# Altium project LTO 16S BMS v1.0.PrjPcb
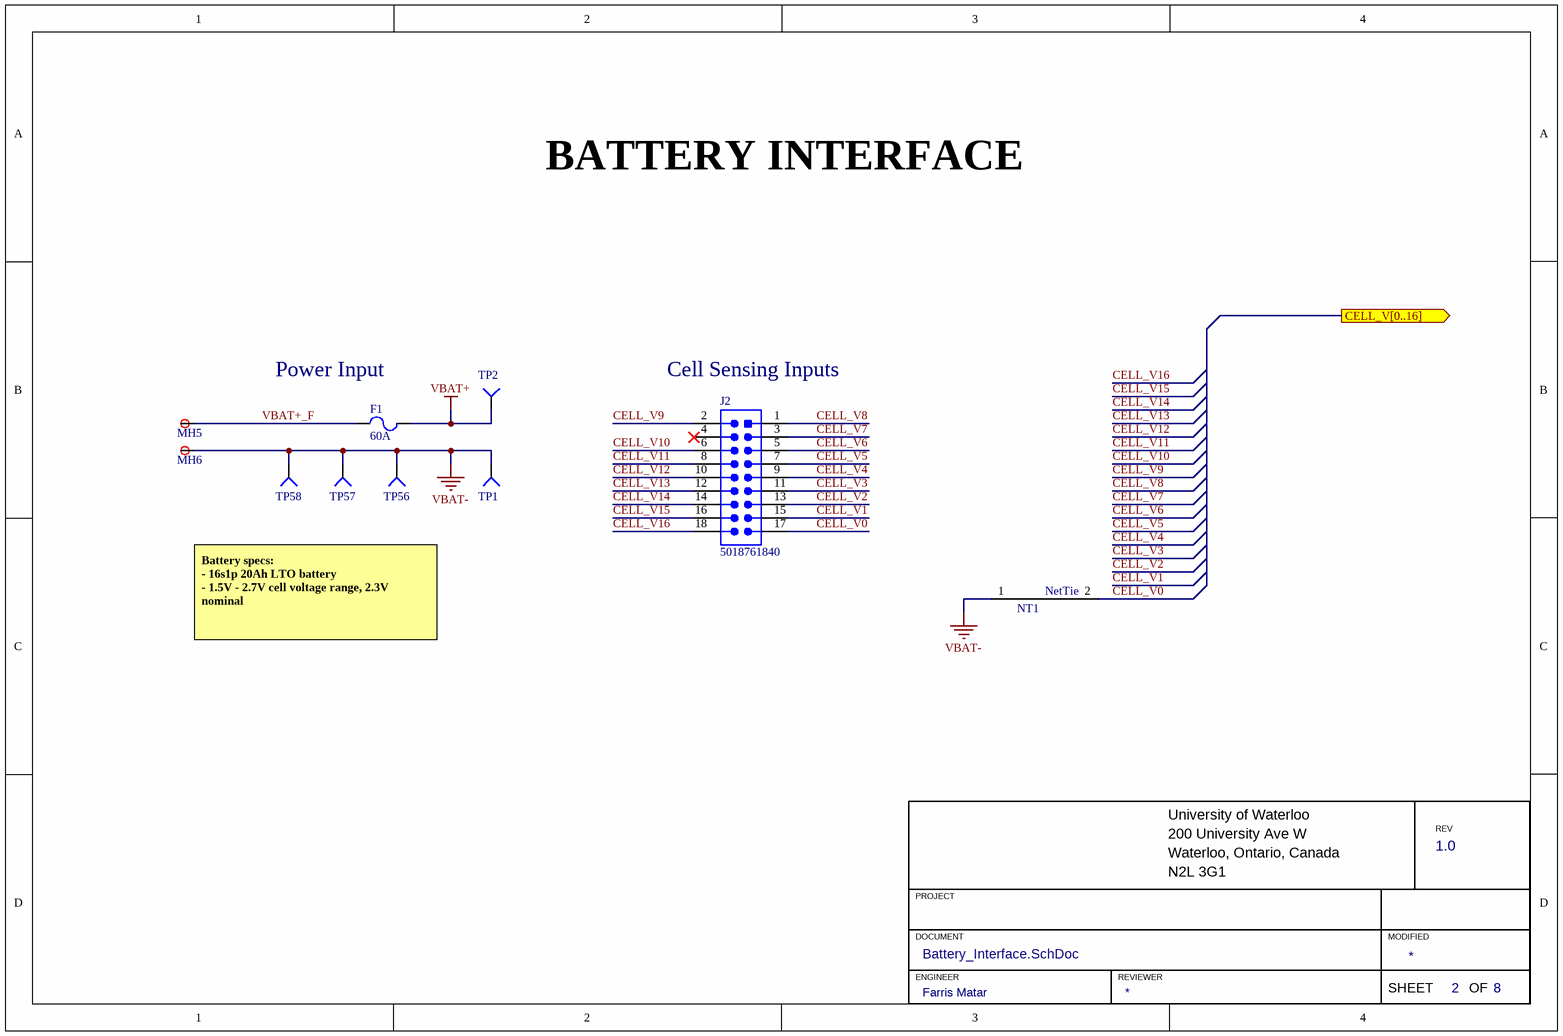
[diagram p0: Battery_Interface.SchDoc]
Engineer: Farris Matar; Revision: 1.0; Title: LTO 16S BMS
7 sheets, 250 parts. Net scope: hierarchical (ports join the sheet entries above them; power ports are global).
Board file: LTO 16S BMS.PcbDoc
Sheets:
  Battery_Interface.SchDoc
  BQ76952_AFE.SchDoc
    Balancing FETs = Balancing_FETs.SchDoc
  High_Side_FETs.SchDoc
  STM32_MCU.SchDoc
  Temperature_Sense.SchDoc
  Pack_Interface.SchDoc

## Sheet Battery_Interface.SchDoc: LTO 16S BMS
size A4; Engineer: Farris Matar; Organization: TESLA Motors, INC; Address1: 3500 Deer Creek Road; Address2: Palo Alto, CA; Address4: U.S.A.; SheetNumber: 2; SheetTotal: 8

### Parts
F1  Current Rating: 60A  [FUSE_456SDE_LITTLEFUSE]  (hidden comment: FUSE_60A_LITTLEFUSE)
J2  5018761840  [MOLEX-IGRID 9X2 THRA]
MH5  MOUNTING_HOLE_M5  [MOUNTING_HOLE_5mm]  (value not drawn)  (no BOM)
MH6  MOUNTING_HOLE_M5  [MOUNTING_HOLE_5mm]  (value not drawn)  (no BOM)
NT1  NetTie  [NET_TIE]  (value not drawn)
TP1  TESTPOINT_SMD_LOOP  [S1751-46R]  (value not drawn)
TP2  TESTPOINT_SMD_LOOP  [S1751-46R]  (value not drawn)
TP56  TESTPOINT_SMD_LOOP  [S1751-46R]  (value not drawn)
TP57  TESTPOINT_SMD_LOOP  [S1751-46R]  (value not drawn)
TP58  TESTPOINT_SMD_LOOP  [S1751-46R]  (value not drawn)

### Ports
CELL_V[0..16] (out)

### Nets
VBAT+: F1.2 TP2.1(=value)
VBAT-: MH6.0 NT1.1 TP1.1(=value) TP56.1(=value) TP57.1(=value) TP58.1(=value)
CELL_V0: J2.17 NT1.2
CELL_V1: J2.15
CELL_V2: J2.13
CELL_V3: J2.11
CELL_V4: J2.9
CELL_V5: J2.7
CELL_V6: J2.5
CELL_V7: J2.3
CELL_V8: J2.1
CELL_V9: J2.2
CELL_V10: J2.6
CELL_V11: J2.8
CELL_V12: J2.10
CELL_V13: J2.12
CELL_V14: J2.14
CELL_V15: J2.16
CELL_V16: J2.18
VBAT+_F: F1.1 MH5.0

Not connected (* = marked no-connect by the designer): J2 4*

### Notes on the sheet
- BATTERY INTERFACE
- (near F1) Power Input
- (near J2) Cell Sensing Inputs
- Battery specs:
  - 16s1p 20Ah LTO battery
  - 1.5V - 2.7V cell voltage range, 2.3V nominal
- University of Waterloo
- 200 University Ave W
- REV
- PROJECT
- Waterloo, Ontario, Canada
- N2L 3G1
- DOCUMENT
- ENGINEER
- REVIEWER
- MODIFIED
- SHEET
- OF

### Library data of the parts
F1 = FUSE_60A_LITTLEFUSE: FUSE BRD MT 60A 250VAC 80VDC SMD; Manufacturer 1: Littelfuse Inc.; Manufacturer Part Number 1: 0456060.DRSDE; Mounting Type: SMD; Verified: No; Supplier 1: Digi-Key; Supplier Part Number 1: 18-0456060.DRSDECT-ND
J2 = CON_MOLEX-IGRID_9x2_THRA: CONN HEADER R/A 18POS 2MM; Manufacturer 1: Molex; Voltage Rating: 250V; Current Rating: 7.5A; Pitch: 2mm; Supplier 1: Digi-Key; Supplier Part Number 1: WM12314-ND; Manufacturer Part Number 1: 5018761840
TP1 TP2 TP56-TP58 = TESTPOINT_SMD_LOOP: TESTPOINT SMD LOOP; Manufacturer 1: Harwin; Supplier 1: Digi-Key; Manufacturer Part Number 1: S1751-46R; Mounting Type: SMD; Package/Footprint: SMD; Supplier Part Number 1: 952-1478-1-ND

## Sheet BQ76952_AFE.SchDoc: LTO 16S BMS
size A4; Engineer: Farris Matar; Organization: TESLA Motors, INC; Address1: 3500 Deer Creek Road; Address2: Palo Alto, CA; Address4: U.S.A.; SheetNumber: 3; SheetTotal: 8
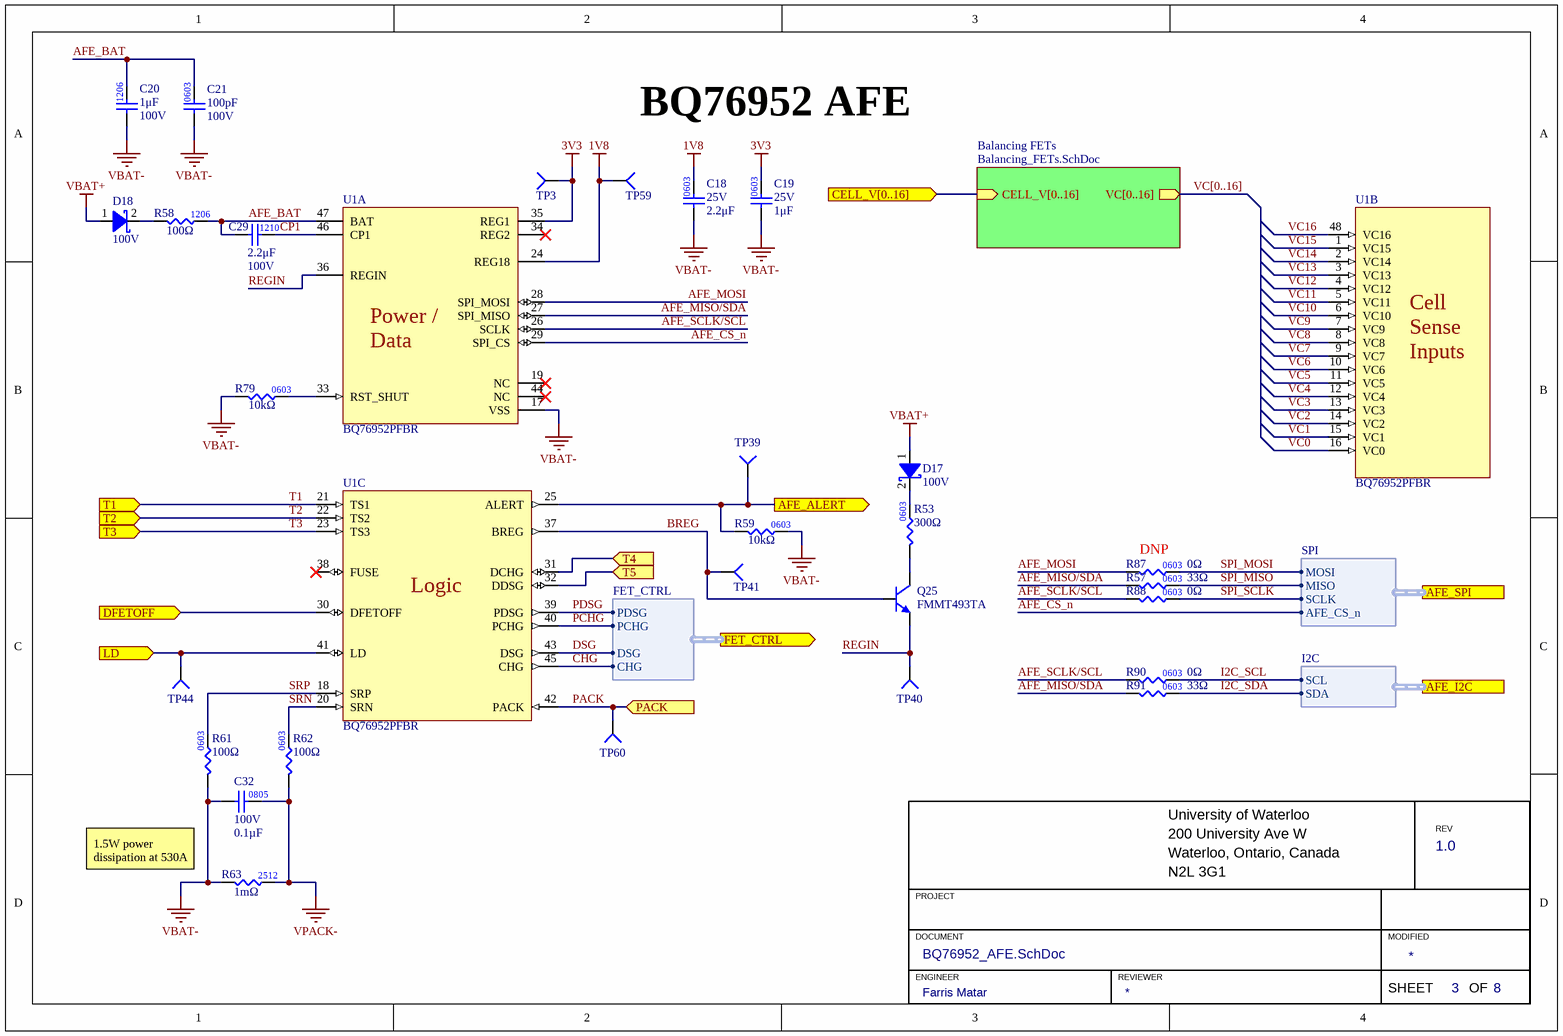
[diagram p1: BQ76952_AFE.SchDoc]

### Parts
C18  value 2.2μF  Voltage Rating: 25V  [CAP0603]  (hidden comment: CAP_2.2uF_25V_0603)
C19  value 1μF  Voltage Rating: 25V  [CAP0603]  (hidden comment: CAP_1uF_25V_0603)
C20  value 1μF  Voltage Rating: 100V  [CAP1206]  (hidden comment: CAP_1uF_100V_1206)
C21  value 100pF  Voltage Rating: 100V  [CAP2012]  (hidden comment: CAP_100pF_100V_0603)
C29  value 2.2μF  Voltage Rating: 100V  [CAP1210]  (hidden comment: CAP_2.2uF_100V_1210)
C32  value 0.1µF  Voltage Rating: 100V  [CAP0805]  (hidden comment: CAP_0.1uF_100V_0805)
D17  Vr (Max): 100V  [SOD-123_FLAT]  (hidden comment: DIO_SCHOTTKY_100V_1A)
D18  Vr (Max): 100V  [SOD-123_FLAT]  (hidden comment: DIO_SCHOTTKY_100V_1A)
Q25  Manufacturer Part Number 1: FMMT493TA  [SOT23-3]  (hidden comment: NPN_100V_1A)
R53  value 300Ω  [RES0603]  (hidden comment: RES_300Ω_0603_1%)
R57  value 33Ω  [RES0603]  (hidden comment: RES_33Ω_0603_1%)
R58  value 100Ω  [RES1206]  (hidden comment: RES_100Ω_1206_1%)
R59  value 10kΩ  [RES0603]  (hidden comment: RES_10kΩ_0603_1%)
R61  value 100Ω  [RES0603]  (hidden comment: RES_100Ω_0603_1%)
R62  value 100Ω  [RES0603]  (hidden comment: RES_100Ω_0603_1%)
R63  value 1mΩ  [RESC6532X75N]  (hidden comment: RES_1mΩ_2512_1%)
R79  value 10kΩ  [RES0603]  (hidden comment: RES_10kΩ_0603_1%)
R87  value 0Ω  [RES0603]  (hidden comment: RES_0Ω_0603)
R88  value 0Ω  [RES0603]  (hidden comment: RES_0Ω_0603)
R90  value 0Ω  [RES0603]  (hidden comment: RES_0Ω_0603)
R91  value 33Ω  [RES0603]  (hidden comment: RES_33Ω_0603_1%)
TP3  TESTPOINT_SMD_LOOP  [S1751-46R]  (value not drawn)
TP39  TESTPOINT_1MM_CIRCLE  [TESTPOINT_CIRCLE_1MM]  (value not drawn)  (no BOM)
TP40  TESTPOINT_1MM_CIRCLE  [TESTPOINT_CIRCLE_1MM]  (value not drawn)  (no BOM)
TP41  TESTPOINT_1MM_CIRCLE  [TESTPOINT_CIRCLE_1MM]  (value not drawn)  (no BOM)
TP44  TESTPOINT_1MM_CIRCLE  [TESTPOINT_CIRCLE_1MM]  (value not drawn)  (no BOM)
TP59  TESTPOINT_1MM_SQUARE  [TESTPOINT_SQUARE_1MM]  (value not drawn)  (no BOM)
TP60  TESTPOINT_1MM_CIRCLE  [TESTPOINT_CIRCLE_1MM]  (value not drawn)  (no BOM)
U1  BQ76952PFBR  [TI_48-TQFP]  (parts A,B,C of 3)

### Sub-sheets
Balancing FETs = Balancing_FETs.SchDoc: CELL_V[0..16] (in), VC[0..16] (out)

### Ports
AFE_ALERT (out), AFE_I2C (harness I2C), AFE_SPI (harness SPI), CELL_V[0..16] (in), DFETOFF (in), FET_CTRL (out, harness FET_CTRL), LD (in), PACK (in), T1 (in), T2 (in), T3 (in), T4 (in), T5 (in)

### Harnesses
SPI: MOSI, MISO, SCLK, AFE_CS_n
FET_CTRL: PDSG, PCHG, DSG, CHG
I2C: SCL, SDA

### Nets
1V8: C18.2 TP59.1(=value) U1.24(REG18)
3V3: C19.2 TP3.1(=value) U1.35(REG1)
VBAT+: D17.1(Anode) D18.1(Anode)
VBAT-: C18.1 C19.1 C20.1 C21.1 C32.1 R59.2 R61.1 R63.1 R79.1 U1.17(VSS)
VPACK-: C32.2 R62.1 R63.2
AFE_BAT: C20.2 C21.2 C29.1 R58.2 U1.47(BAT)
AFE_CS_n: U1.29(SPI_CS) ; port AFE_SPI.AFE_CS_n
AFE_MISO/SDA: R57.1 R91.1 U1.27(SPI_MISO)
AFE_MOSI: R87.1 U1.28(SPI_MOSI)
AFE_SCLK/SCL: R88.1 R90.1 U1.26(SCLK)
BREG: Q25.1(B) TP41.1(=value) U1.37(BREG)
CHG: U1.45(CHG) ; port FET_CTRL.CHG
CP1: C29.2 U1.46(CP1)
DSG: U1.43(DSG) ; port FET_CTRL.DSG
I2C_SCL: R90.2 ; port AFE_I2C.SCL
I2C_SDA: R91.2 ; port AFE_I2C.SDA
PACK: TP60.1(=value) U1.42(PACK) ; port PACK
PCHG: U1.40(PCHG) ; port FET_CTRL.PCHG
PDSG: U1.39(PDSG) ; port FET_CTRL.PDSG
REGIN: Q25.2(E) TP40.1(=value) U1.36(REGIN)
SPI_MISO: R57.2 ; port AFE_SPI.MISO
SPI_MOSI: R87.2 ; port AFE_SPI.MOSI
SPI_SCLK: R88.2 ; port AFE_SPI.SCLK
SRN: R62.2 U1.20(SRN)
SRP: R61.2 U1.18(SRP)
T1: U1.21(TS1) ; port T1
T2: U1.22(TS2) ; port T2
T3: U1.23(TS3) ; port T3
VC0: U1.16(VC0)
VC1: U1.15(VC1)
VC2: U1.14(VC2)
VC3: U1.13(VC3)
VC4: U1.12(VC4)
VC5: U1.11(VC5)
VC6: U1.10(VC6)
VC7: U1.9(VC7)
VC8: U1.8(VC8)
VC9: U1.7(VC9)
VC10: U1.6(VC10)
VC11: U1.5(VC11)
VC12: U1.4(VC12)
VC13: U1.3(VC13)
VC14: U1.2(VC14)
VC15: U1.1(VC15)
VC16: U1.48(VC16)
NetD17_2: D17.2(Cathode) R53.2
NetD18_2: D18.2(Cathode) R58.1
NetQ25_3: Q25.3(C) R53.1
NetR59_1: R59.1 TP39.1(=value) U1.25(ALERT) ; port AFE_ALERT
NetR79_2: R79.2 U1.33(RST_SHUT)
NetTP44_1: TP44.1(=value) U1.41(LD) ; port LD
NetU1_30: U1.30(DFETOFF) ; port DFETOFF
NetU1_31: U1.31(DCHG) ; port T4
NetU1_32: U1.32(DDSG) ; port T5

Not connected (* = marked no-connect by the designer): U1 19(NC)* 34(REG2)* 38(FUSE)* 44(NC)*

### Buses and harness runs
bus port CELL_V[0..16] = sheet Balancing FETs/CELL_V[0..16]
bus VC[0..16] = sheet Balancing FETs/VC[0..16]

### Notes on the sheet
- BQ76952 AFE
- (near R87) DNP
- University of Waterloo
- 200 University Ave W
- REV
- 1.5W power dissipation at 530A
- PROJECT
- Waterloo, Ontario, Canada
- N2L 3G1
- DOCUMENT
- ENGINEER
- REVIEWER
- MODIFIED
- SHEET
- OF
- (in symbol BQ7695204PFBR, part A) Power / / Data
- (in symbol BQ7695204PFBR, part B) Cell / Sense / Inputs
- (in symbol BQ7695204PFBR, part C) Logic
- (in symbol CAP_2.2uF_25V_0603) 0603
- (in symbol CAP_2.2uF_100V_1210) 1210
- (in symbol RES_100Ω_0603_1%) 0603

### Library data of the parts
C18 = CAP_2.2uF_25V_0603: CAP CER 2.2UF 25V X5R 0603; Manufacturer Part Number 1: C1608X5R1E225K080AB; Manufacturer 1: TDK Corporation; Dielectric: 5; Supplier Part Number 1: 445-5964-1-ND; Supplier 1: Digi-Key
C19 = CAP_1uF_25V_0603: CAP CER 1UF 25V X5R 0603; Manufacturer 1: Samsung; Manufacturer Part Number 1: CL10A105KA8NNNC; Supplier 1: Digi-Key; Mounting Type: SMD; Package: 0603; Supplier Part Number 1: 1276-1102-1-ND; Dielectric: X5R
C20 = CAP_1uF_100V_1206: CAP CER 1UF 100V X7R 1206; Supplier 1: Digi-Key; Mounting Type: SMD; Package: 1206; Supplier Part Number 1: 490-16468-1-ND
C21 = CAP_100pF_100V_0603: CAP CER 100PF 100V X7R 0603; Manufacturer 1: YAGEO; Manufacturer Part Number 1: CC0603KRX7R0BB101; Package/Footprint: 0603; Mounting Type: SMD; Dielectric: X7R; Supplier 1: Digi-Key; Supplier Part Number 1: 311-4048-1-ND
C29 = CAP_2.2uF_100V_1210: CAP CER 2.2UF 100V X7R 1210; Manufacturer 1: Taiyo Yuden; Manufacturer Part Number 1: HMK325B7225KMHP; Dielectric: X7R; Supplier 1: Digi-Key; Supplier Part Number 1: 587-5396-1-ND
C32 = CAP_0.1uF_100V_0805: CAP CER 0.1UF 100V X7R 0805; Manufacturer 1: TDK Corporation; Manufacturer Part Number 1: C2012X7R2A104K125AA; Package: 0805; Supplier 1: Digi-Key; Supplier Part Number 1: 445-1418-1-ND
D17 D18 = DIO_SCHOTTKY_100V_1A: DIODE SCHOTTKY 100V 1A SOD-123F; Manufacturer 1: SMC Diode Solutions; Manufacturer Part Number 1: DSS110U; Supplier 1: Digi-Key; Supplier Part Number 1: 1655-DSS110UCT-ND; Mounting Type: SMD; Package/Footprint: SOD-123F
Q25 = NPN_100V_1A: TRANS NPN 100V 1A SOT23-3; Manufacturer 1: Diodes Incorporated; Package: SOT-23-3; Supplier Part Number 1: FMMT493CT-ND; Supplier 1: Digi-Key
R53 = RES_300Ω_0603_1%: RES 200 OHM 1% 1/10W 0603; Manufacturer 1: YAGEO; Manufacturer Part Number 1: RL0603FR-070R3L; Supplier 1: Digi-Key; Supplier Part Number 1: 13-RL0603FR-070R3LCT-ND; Package: 0603; Tolerance: 1%
R57 R91 = RES_33Ω_0603_1%: RES 33 OHM 1% 1/10W 0603; Manufacturer 1: Vishay; Manufacturer Part Number 1: CRCW060333R0FKEA; Supplier 1: Digi-Key; Mounting Type: SMD; Supplier Part Number 1: 541-33.0HCT-ND; Package: 0603
R58 = RES_100Ω_1206_1%: RES 100 OHM 1% 1/4W 1206; Manufacturer 1: YAGEO; Manufacturer Part Number 1: RC1206FR-07100RL; Package/Footprint: 1206; Supplier 1: Digi-Key; Mounting Type: SMD; Supplier Part Number 1: 311-100FRCT-ND
R59 R79 = RES_10kΩ_0603_1%: RES 10K OHM 1% 1/8W 0603; Manufacturer 1: Stackpole Electronics Inc; Manufacturer Part Number 1: RNCP0603FTD10K0; Supplier Part Number 1: RNCP0603FTD10K0CT-ND; Supplier 1: Digi-Key; Mounting Type: SMD; Package: 0603
R61 R62 = RES_100Ω_0603_1%: RES 100 OHM 1% 1/10W 0603; Manufacturer 1: Yageo; Manufacturer Part Number 1: RC0603FR-07100RL; Supplier Part Number 1: 311-100HRCT-ND; Supplier 1: Digi-Key
R63 = RES_1mΩ_2512_1%: RES 1 mOHM 1% 3W 2512; Manufacturer 1: Riedon; Manufacturer Part Number 1: CSRL3-0R001F8; Supplier 1: Digi-Key; Supplier Part Number 1: 696-1834-1-ND; Mounting Type: SMD; Package: 2512
R87 R88 R90 = RES_0Ω_0603: RES 0 OHM JUMPER 1/10W 0603; Manufacturer 1: Yageo; Manufacturer Part Number 1: RC0603JR-070RL; Supplier Part Number 1: 311-0.0GRCT-ND; Supplier 1: Digi-Key; Mounting Type: SMD; Package: 0603
TP3 = TESTPOINT_SMD_LOOP: as TP1 on sheet Battery_Interface; Supplier 1: Digi-Key; Manufacturer Part Number 1: S1751-46R; Mounting Type: SMD; Package/Footprint: SMD; Supplier Part Number 1: 952-1478-1-ND
TP39-TP41 TP44 TP60 = TESTPOINT_1MM_CIRCLE: TESTPOINT 1MM CIRCLE
TP59 = TESTPOINT_1MM_SQUARE: TESTPOINT 1MM SQUARE
U1 = BQ7695204PFBR: IC BAT LIFEPO4/LI-ION 3-16C TQFP; Manufacturer 1: Texas Instruments; Package/Footprint: 48-TQFP; Manufacturer Part Number 1: BQ76952PFBR; Supplier 1: Digi-Key; Supplier Part Number 1: 296-BQ76952PFBRCT-ND

## Sheet Balancing_FETs.SchDoc: LTO 16S BMS
size A4; Engineer: Farris Matar; Organization: TESLA Motors, INC; Address1: 3500 Deer Creek Road; Address2: Palo Alto, CA; Address4: U.S.A.; SheetNumber: 4; SheetTotal: 8
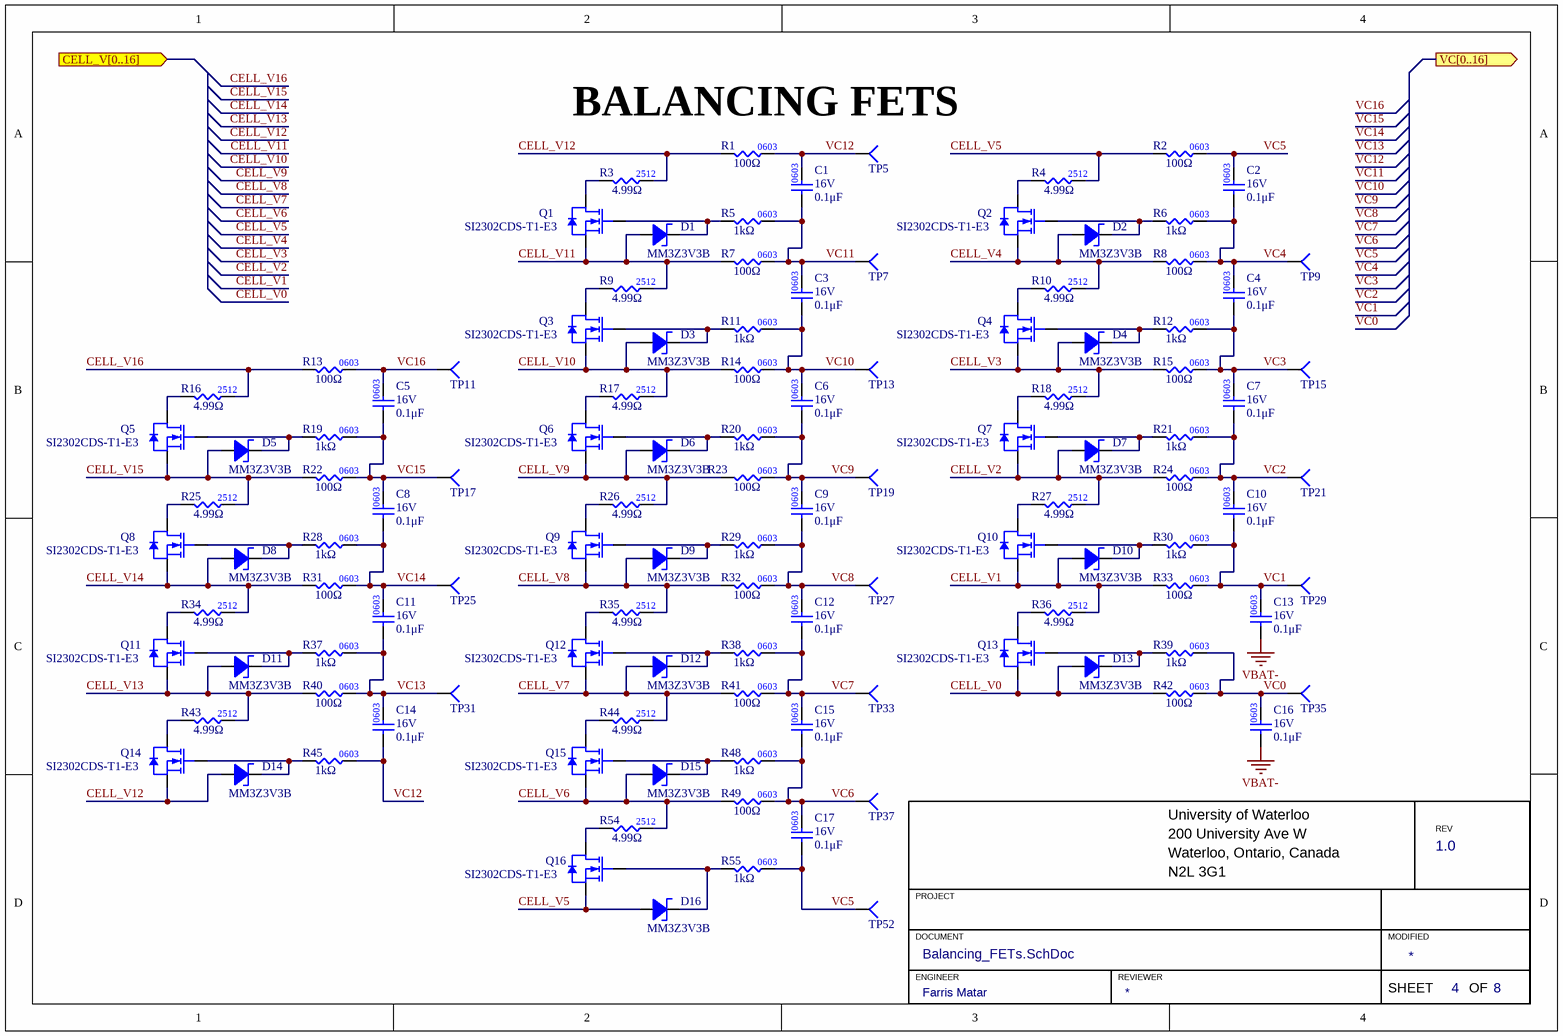
[diagram p2: Balancing_FETs.SchDoc]

### Parts
C1  value 0.1μF  Voltage Rating: 16V  [CAP0603]  (hidden comment: CAP_0.1uF_16V_0603)
C2  value 0.1μF  Voltage Rating: 16V  [CAP0603]  (hidden comment: CAP_0.1uF_16V_0603)
C3  value 0.1μF  Voltage Rating: 16V  [CAP0603]  (hidden comment: CAP_0.1uF_16V_0603)
C4  value 0.1μF  Voltage Rating: 16V  [CAP0603]  (hidden comment: CAP_0.1uF_16V_0603)
C5  value 0.1μF  Voltage Rating: 16V  [CAP0603]  (hidden comment: CAP_0.1uF_16V_0603)
C6  value 0.1μF  Voltage Rating: 16V  [CAP0603]  (hidden comment: CAP_0.1uF_16V_0603)
C7  value 0.1μF  Voltage Rating: 16V  [CAP0603]  (hidden comment: CAP_0.1uF_16V_0603)
C8  value 0.1μF  Voltage Rating: 16V  [CAP0603]  (hidden comment: CAP_0.1uF_16V_0603)
C9  value 0.1μF  Voltage Rating: 16V  [CAP0603]  (hidden comment: CAP_0.1uF_16V_0603)
C10  value 0.1μF  Voltage Rating: 16V  [CAP0603]  (hidden comment: CAP_0.1uF_16V_0603)
C11  value 0.1μF  Voltage Rating: 16V  [CAP0603]  (hidden comment: CAP_0.1uF_16V_0603)
C12  value 0.1μF  Voltage Rating: 16V  [CAP0603]  (hidden comment: CAP_0.1uF_16V_0603)
C13  value 0.1μF  Voltage Rating: 16V  [CAP0603]  (hidden comment: CAP_0.1uF_16V_0603)
C14  value 0.1μF  Voltage Rating: 16V  [CAP0603]  (hidden comment: CAP_0.1uF_16V_0603)
C15  value 0.1μF  Voltage Rating: 16V  [CAP0603]  (hidden comment: CAP_0.1uF_16V_0603)
C16  value 0.1μF  Voltage Rating: 16V  [CAP0603]  (hidden comment: CAP_0.1uF_16V_0603)
C17  value 0.1μF  Voltage Rating: 16V  [CAP0603]  (hidden comment: CAP_0.1uF_16V_0603)
D1  Manufacturer Part Number 1: MM3Z3V3B  [DIO_ZENER_3V3]  (hidden comment: DIO_ZENER_3V3)
D2  Manufacturer Part Number 1: MM3Z3V3B  [DIO_ZENER_3V3]  (hidden comment: DIO_ZENER_3V3)
D3  Manufacturer Part Number 1: MM3Z3V3B  [DIO_ZENER_3V3]  (hidden comment: DIO_ZENER_3V3)
D4  Manufacturer Part Number 1: MM3Z3V3B  [DIO_ZENER_3V3]  (hidden comment: DIO_ZENER_3V3)
D5  Manufacturer Part Number 1: MM3Z3V3B  [DIO_ZENER_3V3]  (hidden comment: DIO_ZENER_3V3)
D6  Manufacturer Part Number 1: MM3Z3V3B  [DIO_ZENER_3V3]  (hidden comment: DIO_ZENER_3V3)
D7  Manufacturer Part Number 1: MM3Z3V3B  [DIO_ZENER_3V3]  (hidden comment: DIO_ZENER_3V3)
D8  Manufacturer Part Number 1: MM3Z3V3B  [DIO_ZENER_3V3]  (hidden comment: DIO_ZENER_3V3)
D9  Manufacturer Part Number 1: MM3Z3V3B  [DIO_ZENER_3V3]  (hidden comment: DIO_ZENER_3V3)
D10  Manufacturer Part Number 1: MM3Z3V3B  [DIO_ZENER_3V3]  (hidden comment: DIO_ZENER_3V3)
D11  Manufacturer Part Number 1: MM3Z3V3B  [DIO_ZENER_3V3]  (hidden comment: DIO_ZENER_3V3)
D12  Manufacturer Part Number 1: MM3Z3V3B  [DIO_ZENER_3V3]  (hidden comment: DIO_ZENER_3V3)
D13  Manufacturer Part Number 1: MM3Z3V3B  [DIO_ZENER_3V3]  (hidden comment: DIO_ZENER_3V3)
D14  Manufacturer Part Number 1: MM3Z3V3B  [DIO_ZENER_3V3]  (hidden comment: DIO_ZENER_3V3)
D15  Manufacturer Part Number 1: MM3Z3V3B  [DIO_ZENER_3V3]  (hidden comment: DIO_ZENER_3V3)
D16  Manufacturer Part Number 1: MM3Z3V3B  [DIO_ZENER_3V3]  (hidden comment: DIO_ZENER_3V3)
Q1  Manufacturer Part Number 1: SI2302CDS-T1-E3  [SOT23-3]  (hidden comment: NMOS_20V_6A)
Q2  Manufacturer Part Number 1: SI2302CDS-T1-E3  [SOT23-3]  (hidden comment: NMOS_20V_6A)
Q3  Manufacturer Part Number 1: SI2302CDS-T1-E3  [SOT23-3]  (hidden comment: NMOS_20V_6A)
Q4  Manufacturer Part Number 1: SI2302CDS-T1-E3  [SOT23-3]  (hidden comment: NMOS_20V_6A)
Q5  Manufacturer Part Number 1: SI2302CDS-T1-E3  [SOT23-3]  (hidden comment: NMOS_20V_6A)
Q6  Manufacturer Part Number 1: SI2302CDS-T1-E3  [SOT23-3]  (hidden comment: NMOS_20V_6A)
Q7  Manufacturer Part Number 1: SI2302CDS-T1-E3  [SOT23-3]  (hidden comment: NMOS_20V_6A)
Q8  Manufacturer Part Number 1: SI2302CDS-T1-E3  [SOT23-3]  (hidden comment: NMOS_20V_6A)
Q9  Manufacturer Part Number 1: SI2302CDS-T1-E3  [SOT23-3]  (hidden comment: NMOS_20V_6A)
Q10  Manufacturer Part Number 1: SI2302CDS-T1-E3  [SOT23-3]  (hidden comment: NMOS_20V_6A)
Q11  Manufacturer Part Number 1: SI2302CDS-T1-E3  [SOT23-3]  (hidden comment: NMOS_20V_6A)
Q12  Manufacturer Part Number 1: SI2302CDS-T1-E3  [SOT23-3]  (hidden comment: NMOS_20V_6A)
Q13  Manufacturer Part Number 1: SI2302CDS-T1-E3  [SOT23-3]  (hidden comment: NMOS_20V_6A)
Q14  Manufacturer Part Number 1: SI2302CDS-T1-E3  [SOT23-3]  (hidden comment: NMOS_20V_6A)
Q15  Manufacturer Part Number 1: SI2302CDS-T1-E3  [SOT23-3]  (hidden comment: NMOS_20V_6A)
Q16  Manufacturer Part Number 1: SI2302CDS-T1-E3  [SOT23-3]  (hidden comment: NMOS_20V_6A)
R1  value 100Ω  [RES0603]  (hidden comment: RES_100Ω_0603_1%)
R2  value 100Ω  [RES0603]  (hidden comment: RES_100Ω_0603_1%)
R3  value 4.99Ω  [RES2512]  (hidden comment: RES_4.99Ω_2512_1%)
R4  value 4.99Ω  [RES2512]  (hidden comment: RES_4.99Ω_2512_1%)
R5  value 1kΩ  [RES0603]  (hidden comment: RES_1kΩ_0603_1%)
R6  value 1kΩ  [RES0603]  (hidden comment: RES_1kΩ_0603_1%)
R7  value 100Ω  [RES0603]  (hidden comment: RES_100Ω_0603_1%)
R8  value 100Ω  [RES0603]  (hidden comment: RES_100Ω_0603_1%)
R9  value 4.99Ω  [RES2512]  (hidden comment: RES_4.99Ω_2512_1%)
R10  value 4.99Ω  [RES2512]  (hidden comment: RES_4.99Ω_2512_1%)
R11  value 1kΩ  [RES0603]  (hidden comment: RES_1kΩ_0603_1%)
R12  value 1kΩ  [RES0603]  (hidden comment: RES_1kΩ_0603_1%)
R13  value 100Ω  [RES0603]  (hidden comment: RES_100Ω_0603_1%)
R14  value 100Ω  [RES0603]  (hidden comment: RES_100Ω_0603_1%)
R15  value 100Ω  [RES0603]  (hidden comment: RES_100Ω_0603_1%)
R16  value 4.99Ω  [RES2512]  (hidden comment: RES_4.99Ω_2512_1%)
R17  value 4.99Ω  [RES2512]  (hidden comment: RES_4.99Ω_2512_1%)
R18  value 4.99Ω  [RES2512]  (hidden comment: RES_4.99Ω_2512_1%)
R19  value 1kΩ  [RES0603]  (hidden comment: RES_1kΩ_0603_1%)
R20  value 1kΩ  [RES0603]  (hidden comment: RES_1kΩ_0603_1%)
R21  value 1kΩ  [RES0603]  (hidden comment: RES_1kΩ_0603_1%)
R22  value 100Ω  [RES0603]  (hidden comment: RES_100Ω_0603_1%)
R23  value 100Ω  [RES0603]  (hidden comment: RES_100Ω_0603_1%)
R24  value 100Ω  [RES0603]  (hidden comment: RES_100Ω_0603_1%)
R25  value 4.99Ω  [RES2512]  (hidden comment: RES_4.99Ω_2512_1%)
R26  value 4.99Ω  [RES2512]  (hidden comment: RES_4.99Ω_2512_1%)
R27  value 4.99Ω  [RES2512]  (hidden comment: RES_4.99Ω_2512_1%)
R28  value 1kΩ  [RES0603]  (hidden comment: RES_1kΩ_0603_1%)
R29  value 1kΩ  [RES0603]  (hidden comment: RES_1kΩ_0603_1%)
R30  value 1kΩ  [RES0603]  (hidden comment: RES_1kΩ_0603_1%)
R31  value 100Ω  [RES0603]  (hidden comment: RES_100Ω_0603_1%)
R32  value 100Ω  [RES0603]  (hidden comment: RES_100Ω_0603_1%)
R33  value 100Ω  [RES0603]  (hidden comment: RES_100Ω_0603_1%)
R34  value 4.99Ω  [RES2512]  (hidden comment: RES_4.99Ω_2512_1%)
R35  value 4.99Ω  [RES2512]  (hidden comment: RES_4.99Ω_2512_1%)
R36  value 4.99Ω  [RES2512]  (hidden comment: RES_4.99Ω_2512_1%)
R37  value 1kΩ  [RES0603]  (hidden comment: RES_1kΩ_0603_1%)
R38  value 1kΩ  [RES0603]  (hidden comment: RES_1kΩ_0603_1%)
R39  value 1kΩ  [RES0603]  (hidden comment: RES_1kΩ_0603_1%)
R40  value 100Ω  [RES0603]  (hidden comment: RES_100Ω_0603_1%)
R41  value 100Ω  [RES0603]  (hidden comment: RES_100Ω_0603_1%)
R42  value 100Ω  [RES0603]  (hidden comment: RES_100Ω_0603_1%)
R43  value 4.99Ω  [RES2512]  (hidden comment: RES_4.99Ω_2512_1%)
R44  value 4.99Ω  [RES2512]  (hidden comment: RES_4.99Ω_2512_1%)
R45  value 1kΩ  [RES0603]  (hidden comment: RES_1kΩ_0603_1%)
R48  value 1kΩ  [RES0603]  (hidden comment: RES_1kΩ_0603_1%)
R49  value 100Ω  [RES0603]  (hidden comment: RES_100Ω_0603_1%)
R54  value 4.99Ω  [RES2512]  (hidden comment: RES_4.99Ω_2512_1%)
R55  value 1kΩ  [RES0603]  (hidden comment: RES_1kΩ_0603_1%)
TP5  TESTPOINT_1MM_SQUARE  [TESTPOINT_SQUARE_1MM]  (value not drawn)  (no BOM)
TP7  TESTPOINT_1MM_SQUARE  [TESTPOINT_SQUARE_1MM]  (value not drawn)  (no BOM)
TP9  TESTPOINT_1MM_SQUARE  [TESTPOINT_SQUARE_1MM]  (value not drawn)  (no BOM)
TP11  TESTPOINT_1MM_SQUARE  [TESTPOINT_SQUARE_1MM]  (value not drawn)  (no BOM)
TP13  TESTPOINT_1MM_SQUARE  [TESTPOINT_SQUARE_1MM]  (value not drawn)  (no BOM)
TP15  TESTPOINT_1MM_SQUARE  [TESTPOINT_SQUARE_1MM]  (value not drawn)  (no BOM)
TP17  TESTPOINT_1MM_SQUARE  [TESTPOINT_SQUARE_1MM]  (value not drawn)  (no BOM)
TP19  TESTPOINT_1MM_SQUARE  [TESTPOINT_SQUARE_1MM]  (value not drawn)  (no BOM)
TP21  TESTPOINT_1MM_SQUARE  [TESTPOINT_SQUARE_1MM]  (value not drawn)  (no BOM)
TP25  TESTPOINT_1MM_SQUARE  [TESTPOINT_SQUARE_1MM]  (value not drawn)  (no BOM)
TP27  TESTPOINT_1MM_SQUARE  [TESTPOINT_SQUARE_1MM]  (value not drawn)  (no BOM)
TP29  TESTPOINT_1MM_SQUARE  [TESTPOINT_SQUARE_1MM]  (value not drawn)  (no BOM)
TP31  TESTPOINT_1MM_SQUARE  [TESTPOINT_SQUARE_1MM]  (value not drawn)  (no BOM)
TP33  TESTPOINT_1MM_SQUARE  [TESTPOINT_SQUARE_1MM]  (value not drawn)  (no BOM)
TP35  TESTPOINT_1MM_SQUARE  [TESTPOINT_SQUARE_1MM]  (value not drawn)  (no BOM)
TP37  TESTPOINT_1MM_SQUARE  [TESTPOINT_SQUARE_1MM]  (value not drawn)  (no BOM)
TP52  TESTPOINT_1MM_SQUARE  [TESTPOINT_SQUARE_1MM]  (value not drawn)  (no BOM)

### Ports
CELL_V[0..16] (in), VC[0..16] (out)

### Nets
VBAT-: C13.1 C16.1
CELL_V0: D13.1(Anode) Q13.2(SOURCE) R42.1
CELL_V1: D10.1(Anode) Q10.2(SOURCE) R33.1 R36.2
CELL_V2: D7.1(Anode) Q7.2(SOURCE) R24.1 R27.2
CELL_V3: D4.1(Anode) Q4.2(SOURCE) R15.1 R18.2
CELL_V4: D2.1(Anode) Q2.2(SOURCE) R8.1 R10.2
CELL_V5: D16.1(Anode) Q16.2(SOURCE) R2.1 R4.2
CELL_V6: D15.1(Anode) Q15.2(SOURCE) R49.1 R54.2
CELL_V7: D12.1(Anode) Q12.2(SOURCE) R41.1 R44.2
CELL_V8: D9.1(Anode) Q9.2(SOURCE) R32.1 R35.2
CELL_V9: D6.1(Anode) Q6.2(SOURCE) R23.1 R26.2
CELL_V10: D3.1(Anode) Q3.2(SOURCE) R14.1 R17.2
CELL_V11: D1.1(Anode) Q1.2(SOURCE) R7.1 R9.2
CELL_V12: D14.1(Anode) Q14.2(SOURCE) R1.1 R3.2
CELL_V13: D11.1(Anode) Q11.2(SOURCE) R40.1 R43.2
CELL_V14: D8.1(Anode) Q8.2(SOURCE) R31.1 R34.2
CELL_V15: D5.1(Anode) Q5.2(SOURCE) R22.1 R25.2
CELL_V16: R13.1 R16.2
VC0: C16.2 R39.2 R42.2 TP35.1(=value)
VC1: C10.1 C13.2 R30.2 R33.2 TP29.1(=value)
VC2: C7.1 C10.2 R21.2 R24.2 TP21.1(=value)
VC3: C4.1 C7.2 R12.2 R15.2 TP15.1(=value)
VC4: C2.1 C4.2 R6.2 R8.2 TP9.1(=value)
VC5: C2.2 C17.1 R2.2 R55.2 TP52.1(=value)
VC6: C15.1 C17.2 R48.2 R49.2 TP37.1(=value)
VC7: C12.1 C15.2 R38.2 R41.2 TP33.1(=value)
VC8: C9.1 C12.2 R29.2 R32.2 TP27.1(=value)
VC9: C6.1 C9.2 R20.2 R23.2 TP19.1(=value)
VC10: C3.1 C6.2 R11.2 R14.2 TP13.1(=value)
VC11: C1.1 C3.2 R5.2 R7.2 TP7.1(=value)
VC12: C1.2 C14.1 R1.2 R45.2 TP5.1(=value)
VC13: C11.1 C14.2 R37.2 R40.2 TP31.1(=value)
VC14: C8.1 C11.2 R28.2 R31.2 TP25.1(=value)
VC15: C5.1 C8.2 R19.2 R22.2 TP17.1(=value)
VC16: C5.2 R13.2 TP11.1(=value)
NetD1_2: D1.2(Cathode) Q1.1(GATE) R5.1
NetD2_2: D2.2(Cathode) Q2.1(GATE) R6.1
NetD3_2: D3.2(Cathode) Q3.1(GATE) R11.1
NetD4_2: D4.2(Cathode) Q4.1(GATE) R12.1
NetD5_2: D5.2(Cathode) Q5.1(GATE) R19.1
NetD6_2: D6.2(Cathode) Q6.1(GATE) R20.1
NetD7_2: D7.2(Cathode) Q7.1(GATE) R21.1
NetD8_2: D8.2(Cathode) Q8.1(GATE) R28.1
NetD9_2: D9.2(Cathode) Q9.1(GATE) R29.1
NetD10_2: D10.2(Cathode) Q10.1(GATE) R30.1
NetD11_2: D11.2(Cathode) Q11.1(GATE) R37.1
NetD12_2: D12.2(Cathode) Q12.1(GATE) R38.1
NetD13_2: D13.2(Cathode) Q13.1(GATE) R39.1
NetD14_2: D14.2(Cathode) Q14.1(GATE) R45.1
NetD15_2: D15.2(Cathode) Q15.1(GATE) R48.1
NetD16_2: D16.2(Cathode) Q16.1(GATE) R55.1
NetQ1_3: Q1.3(DRAIN) R3.1
NetQ2_3: Q2.3(DRAIN) R4.1
NetQ3_3: Q3.3(DRAIN) R9.1
NetQ4_3: Q4.3(DRAIN) R10.1
NetQ5_3: Q5.3(DRAIN) R16.1
NetQ6_3: Q6.3(DRAIN) R17.1
NetQ7_3: Q7.3(DRAIN) R18.1
NetQ8_3: Q8.3(DRAIN) R25.1
NetQ9_3: Q9.3(DRAIN) R26.1
NetQ10_3: Q10.3(DRAIN) R27.1
NetQ11_3: Q11.3(DRAIN) R34.1
NetQ12_3: Q12.3(DRAIN) R35.1
NetQ13_3: Q13.3(DRAIN) R36.1
NetQ14_3: Q14.3(DRAIN) R43.1
NetQ15_3: Q15.3(DRAIN) R44.1
NetQ16_3: Q16.3(DRAIN) R54.1

### Notes on the sheet
- BALANCING FETS
- University of Waterloo
- 200 University Ave W
- REV
- (near TP52) PROJECT
- Waterloo, Ontario, Canada
- N2L 3G1
- (near TP52) DOCUMENT
- ENGINEER
- REVIEWER
- MODIFIED
- SHEET
- OF
- (in symbol RES_4.99Ω_2512_1%) 2512
- (in symbol RES_100Ω_0603_1%) 0603

### Library data of the parts
C1-C17 = CAP_0.1uF_16V_0603: CAP CER 0.1UF 16V X7R 0603; Manufacturer Part Number 1: CC0603KRX7R7BB104; Manufacturer 1: Yageo; Package: 0603; Supplier Part Number 1: 311-1088-1-ND; Supplier 1: Digi-Key; Dielectric: X7R
D1-D16 = DIO_ZENER_3V3: DIODE ZENER 3.3V 200mW SOD323F; Manufacturer 1: ON Semiconductor / Fairchild; Forward Voltage: 1V; Supplier Part Number 1: MM3Z3V3BCT-ND; Supplier 1: Digi-Key; Package/Case: SOD323F; Working Voltage: 3.3V
Q1-Q16 = NMOS_20V_2.6A: MOSFET N-CH 20V 2.6A SOT23-3; Manufacturer 1: Vishay Siliconix; Package/Footprint: SOT-23-3; Supplier 1: Digi-Key; Supplier Part Number 1: SI2302CDS-T1-E3CT-ND
R1 R2 R7 R8 R13-R15 R22-R24 R31-R33 R40-R42 R49 = RES_100Ω_0603_1%: as R61 on sheet BQ76952_AFE; Supplier Part Number 1: 311-100HRCT-ND; Supplier 1: Digi-Key
R3 R4 R9 R10 R16-R18 R25-R27 R34-R36 R43 R44 R54 = RES_4.99Ω_2512_1%: RES 4.99 OHM 1% 2W 2512; Manufacturer 1: Stackpole Electronics Inc; Manufacturer Part Number 1: RHC2512FT4R99; Supplier 1: Digi-Key; Supplier Part Number 1: RHC2512FT4R99CT-ND
R5 R6 R11 R12 R19-R21 R28-R30 R37-R39 R45 R48 R55 = RES_1kΩ_0603_1%: RES 1K OHM 1% 1/8W 0603; Manufacturer 1: Stackpole Electronics Inc; Manufacturer Part Number 1: RNCP0603FTD1K00; Supplier Part Number 1: RNCP0603FTD1K00CT-ND; Supplier 1: Digi-Key; Mounting Type: SMD; Package: 0603
TP5 TP7 TP9 TP11 TP13 TP15 TP17 TP19 TP21 TP25 TP27 TP29 TP31 TP33 TP35 TP37 TP52 = TESTPOINT_1MM_SQUARE: TESTPOINT 1MM SQUARE

## Sheet High_Side_FETs.SchDoc: LTO 16S BMS
size A4; Engineer: Farris Matar; Organization: TESLA Motors, INC; Address1: 3500 Deer Creek Road; Address2: Palo Alto, CA; Address4: U.S.A.; SheetNumber: 5; SheetTotal: 8
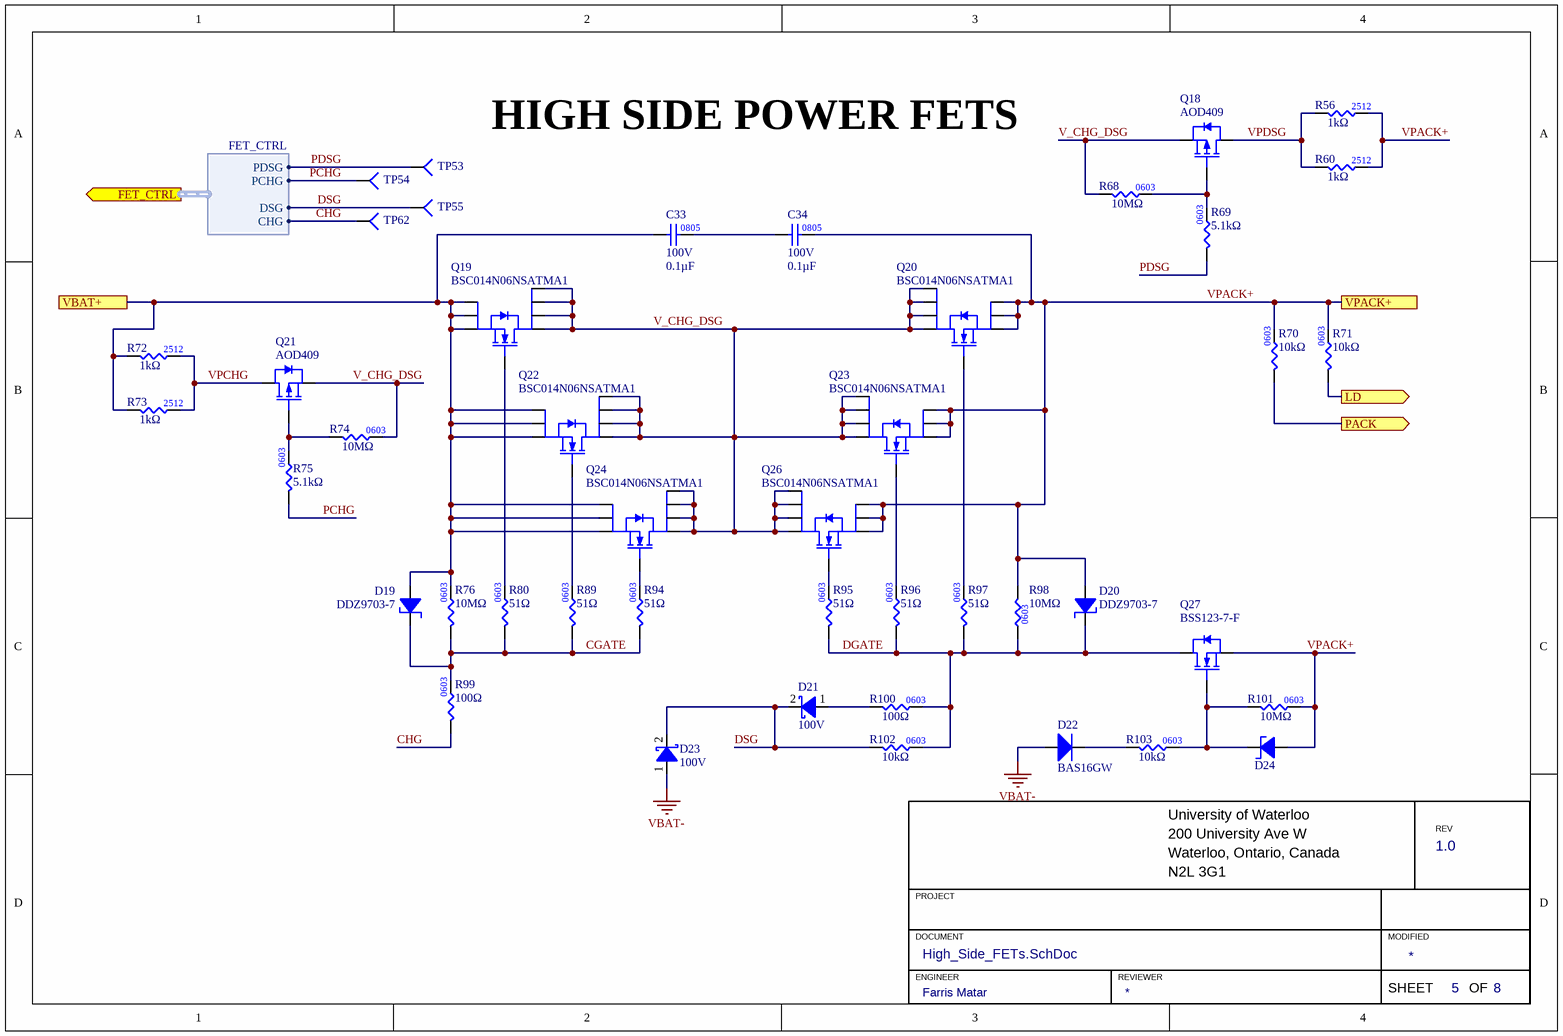
[diagram p3: High_Side_FETs.SchDoc]

### Parts
C33  value 0.1µF  Voltage Rating: 100V  [CAP0805]  (hidden comment: CAP_0.1uF_100V_0805)
C34  value 0.1µF  Voltage Rating: 100V  [CAP0805]  (hidden comment: CAP_0.1uF_100V_0805)
D19  Manufacturer Part Number 1: DDZ9703-7  [SOD-123_FLAT]  (hidden comment: DIO_ZENER_16V)
D20  Manufacturer Part Number 1: DDZ9703-7  [SOD-123_FLAT]  (hidden comment: DIO_ZENER_16V)
D21  Vr (Max): 100V  [SOD-123_FLAT]  (hidden comment: DIO_SCHOTTKY_100V_1A)
D22  Manufacturer Part Number 1: BAS16GW  [DIODSOD-123]  (hidden comment: DIO_100V_215mA)
D23  Vr (Max): 100V  [SOD-123_FLAT]  (hidden comment: DIO_SCHOTTKY_100V_1A)
D24  DIO_ZENER_16V  [SOD-123_FLAT]  (value not drawn)
Q18  Manufacturer Part Number 1: AOD409  [TO-252 AOSMD]  (hidden comment: PMOS_60V_26A)
Q19  Manufacturer Part Number 1: BSC014N06NSATMA1  [INFINEON_8-POWERTDFN]  (hidden comment: NMOS_60V_30A)
Q20  Manufacturer Part Number 1: BSC014N06NSATMA1  [INFINEON_8-POWERTDFN]  (hidden comment: NMOS_60V_30A)
Q21  Manufacturer Part Number 1: AOD409  [TO-252 AOSMD]  (hidden comment: PMOS_60V_26A)
Q22  Manufacturer Part Number 1: BSC014N06NSATMA1  [INFINEON_8-POWERTDFN]  (hidden comment: NMOS_60V_30A)
Q23  Manufacturer Part Number 1: BSC014N06NSATMA1  [INFINEON_8-POWERTDFN]  (hidden comment: NMOS_60V_30A)
Q24  Manufacturer Part Number 1: BSC014N06NSATMA1  [INFINEON_8-POWERTDFN]  (hidden comment: NMOS_60V_30A)
Q26  Manufacturer Part Number 1: BSC014N06NSATMA1  [INFINEON_8-POWERTDFN]  (hidden comment: NMOS_60V_30A)
Q27  Manufacturer Part Number 1: BSS123-7-F  [SOT23-3]  (hidden comment: NMOS_100V_170mA)
R56  value 1kΩ  [RES2512]  (hidden comment: RES_1kΩ_2512_1%)
R60  value 1kΩ  [RES2512]  (hidden comment: RES_1kΩ_2512_1%)
R68  value 10MΩ  [RES0603]  (hidden comment: RES_10MΩ_0603_1%)
R69  value 5.1kΩ  [RES0603]  (hidden comment: RES_5.1kΩ_0603_1%)
R70  value 10kΩ  [RES0603]  (hidden comment: RES_10kΩ_0603_1%)
R71  value 10kΩ  [RES0603]  (hidden comment: RES_10kΩ_0603_1%)
R72  value 1kΩ  [RES2512]  (hidden comment: RES_1kΩ_2512_1%)
R73  value 1kΩ  [RES2512]  (hidden comment: RES_1kΩ_2512_1%)
R74  value 10MΩ  [RES0603]  (hidden comment: RES_10MΩ_0603_1%)
R75  value 5.1kΩ  [RES0603]  (hidden comment: RES_5.1kΩ_0603_1%)
R76  value 10MΩ  [RES0603]  (hidden comment: RES_10MΩ_0603_1%)
R80  value 51Ω  [RES0603]  (hidden comment: RES_51Ω_0603_1%)
R89  value 51Ω  [RES0603]  (hidden comment: RES_51Ω_0603_1%)
R94  value 51Ω  [RES0603]  (hidden comment: RES_51Ω_0603_1%)
R95  value 51Ω  [RES0603]  (hidden comment: RES_51Ω_0603_1%)
R96  value 51Ω  [RES0603]  (hidden comment: RES_51Ω_0603_1%)
R97  value 51Ω  [RES0603]  (hidden comment: RES_51Ω_0603_1%)
R98  value 10MΩ  [RES0603]  (hidden comment: RES_10MΩ_0603_1%)
R99  value 100Ω  [RES0603]  (hidden comment: RES_100Ω_0603_1%)
R100  value 100Ω  [RES0603]  (hidden comment: RES_100Ω_0603_1%)
R101  value 10MΩ  [RES0603]  (hidden comment: RES_10MΩ_0603_1%)
R102  value 10kΩ  [RES0603]  (hidden comment: RES_10kΩ_0603_1%)
R103  value 10kΩ  [RES0603]  (hidden comment: RES_10kΩ_0603_1%)
TP53  TESTPOINT_1MM_CIRCLE  [TESTPOINT_CIRCLE_1MM]  (value not drawn)  (no BOM)
TP54  TESTPOINT_1MM_CIRCLE  [TESTPOINT_CIRCLE_1MM]  (value not drawn)  (no BOM)
TP55  TESTPOINT_1MM_CIRCLE  [TESTPOINT_CIRCLE_1MM]  (value not drawn)  (no BOM)
TP62  TESTPOINT_1MM_CIRCLE  [TESTPOINT_CIRCLE_1MM]  (value not drawn)  (no BOM)

### Ports
FET_CTRL (out, harness FET_CTRL), LD (out), PACK (out), VBAT+, VPACK+

### Harnesses
FET_CTRL: PDSG, PCHG, DSG, CHG

### Nets
VBAT-: D22.1(A) D23.1(Anode)
CGATE: D19.2(Cathode) R76.1 R80.1 R89.1 R94.1 R99.2
CHG: R99.1 TP62.1(=value) ; port FET_CTRL.CHG
DGATE: D20.2(Cathode) Q27.3(DRAIN) R95.1 R96.1 R97.1 R98.1 R100.2 R102.2
DSG: D21.2(Cathode) D23.2(Cathode) R102.1 TP55.1(=value) ; port FET_CTRL.DSG
PCHG: R75.1 TP54.1(=value) ; port FET_CTRL.PCHG
PDSG: R69.1 TP53.1(=value) ; port FET_CTRL.PDSG
V_CHG_DSG: Q18.3(Source) Q19.5(Drain) Q19.6(Drain) Q19.7(Drain) Q19.8(Drain) Q20.5(Drain) Q20.6(Drain) Q20.7(Drain) Q20.8(Drain) Q21.3(Source) Q22.5(Drain) Q22.6(Drain) Q22.7(Drain) Q22.8(Drain) Q23.5(Drain) Q23.6(Drain) Q23.7(Drain) Q23.8(Drain) Q24.5(Drain) Q24.6(Drain) Q24.7(Drain) Q24.8(Drain) Q26.5(Drain) Q26.6(Drain) Q26.7(Drain) Q26.8(Drain) R68.1 R74.2
VPACK+: C34.2 D20.1(Anode) D24.1(Anode) Q20.1(Source) Q20.2(Source) Q20.3(Source) Q23.1(Source) Q23.2(Source) Q23.3(Source) Q26.1(Source) Q26.2(Source) Q26.3(Source) Q27.2(SOURCE) R56.2 R60.2 R70.2 R71.2 R98.2 R101.2 ; port VPACK+
VPCHG: Q21.2(Drain) R72.2 R73.2
VPDSG: Q18.2(Drain) R56.1 R60.1
NetC33_1: C33.1 D19.1(Anode) Q19.1(Source) Q19.2(Source) Q19.3(Source) Q22.1(Source) Q22.2(Source) Q22.3(Source) Q24.1(Source) Q24.2(Source) Q24.3(Source) R72.1 R73.1 R76.2 ; port VBAT+
NetC33_2: C33.2 C34.1
NetD21_1: D21.1(Anode) R100.1
NetD22_2: D22.2(K) R103.1
NetD24_2: D24.2(Cathode) Q27.1(GATE) R101.1 R103.2
NetQ18_1: Q18.1(Gate) R68.2 R69.2
NetQ19_4: Q19.4(Gate) R80.2
NetQ20_4: Q20.4(Gate) R97.2
NetQ21_1: Q21.1(Gate) R74.1 R75.2
NetQ22_4: Q22.4(Gate) R89.2
NetQ23_4: Q23.4(Gate) R96.2
NetQ24_4: Q24.4(Gate) R94.2
NetQ26_4: Q26.4(Gate) R95.2
NetR70_1: R70.1 ; port PACK
NetR71_1: R71.1 ; port LD

### Notes on the sheet
- HIGH SIDE POWER FETS
- University of Waterloo
- 200 University Ave W
- REV
- PROJECT
- Waterloo, Ontario, Canada
- N2L 3G1
- DOCUMENT
- ENGINEER
- REVIEWER
- MODIFIED
- SHEET
- OF
- (in symbol RES_10MΩ_0603_1%) 0603
- (in symbol RES_51Ω_0603_1%) 0603
- (in symbol RES_100Ω_0603_1%) 0603

### Library data of the parts
C33 C34 = CAP_0.1uF_100V_0805: as C32 on sheet BQ76952_AFE; Package: 0805; Supplier 1: Digi-Key; Supplier Part Number 1: 445-1418-1-ND
D19 D20 = DIO_ZENER_16V: DIODE ZENER 16V 500MW SOD123; Manufacturer 1: Diodes Incorporated; Forward Voltage: 900mV; Supplier 1: Digi-Key; Supplier Part Number 1: DDZ9703-7DICT-ND
D21 D23 = DIO_SCHOTTKY_100V_1A: as D17 on sheet BQ76952_AFE; Supplier 1: Digi-Key; Supplier Part Number 1: 1655-DSS110UCT-ND; Mounting Type: SMD; Package/Footprint: SOD-123F
D22 = DIO_100V_215mA: DIODE GEN PURP 100V 215MA SOD123; Manufacturer 1: Nexperia; Package/Footprint: SOD-123; Package: SOD-123; Supplier Part Number 1: 1727-7320-1-ND; Supplier 1: Digi-Key; Mounting Type: SMD; Verified: No
D24 = DIO_ZENER_16V: DIODE ZENER 16V 500MW SOD123; Manufacturer Part Number 1: DDZ9703-7; Manufacturer 1: Diodes Incorporated; Forward Voltage: 900mV; Supplier 1: Digi-Key; Supplier Part Number 1: DDZ9703-7DICT-ND
Q18 Q21 = PMOS_60V_26A: MOSFET P-CH 60V 26A TO252; Manufacturer 1: Alpha & Omega Semiconductor Inc.; Vgs (Max): ±20V; Vdss: 60V; Mounting Type: SMD; Id: 26A; Supplier 1: Digi-Key; Supplier Part Number 1: 785-1103-1-ND
Q19 Q20 Q22-Q24 Q26 = NMOS_60V_30A: MOSFET N-CH 60V 30A/100A TDSON7; Manufacturer 1: Infineon Technologies; FET Type: N-Channel; Vgs (Max): 20V; Power Dissipation (Max): 2.5W; Id: 30A; Supplier 1: Digi-Key; Supplier Part Number 1: BSC014N06NSATMA1CT-ND; Vdss: 60V; Supplier Device Package: 8-PowerTDFN
Q27 = NMOS_100V_170mA: MOSFET N-CH 100V 170MA SOT23-3; Manufacturer 1: Diodes Incorporated; Supplier 1: Digi-Key; Supplier Part Number 1: BSS123-FDICT-ND
R56 R60 R72 R73 = RES_1kΩ_2512_1%: RES SMD 1K OHM 1% 3W 2512; Manufacturer 1: TE Connectivity Passive Product; Manufacturer Part Number 1: 35221K0FT; Supplier Part Number 1: A121161CT-ND; Supplier 1: Digi-Key; Mounting Type: SMD; Package: 2512
R68 R74 R76 R98 R101 = RES_10MΩ_0603_1%: RES 10M OHM 1% 1/10W 0603; Manufacturer 1: YAGEO; Manufacturer Part Number 1: RC0603FR-0710ML; Supplier 1: Digi-Key; Supplier Part Number 1: 311-10.0MHRCT-ND
R69 R75 = RES_5.1kΩ_0603_1%: RES 5.1K OHM 1% 1/10W 0603; Manufacturer 1: YAGEO; Manufacturer Part Number 1: RC0603FR-135K1L; Mounting Type: SMD; Package: 0603; Supplier 1: Digi-Key; Supplier Part Number 1: 13-RC0603FR-135K1LCT-ND
R70 R71 R102 R103 = RES_10kΩ_0603_1%: as R59 on sheet BQ76952_AFE; Supplier Part Number 1: RNCP0603FTD10K0CT-ND; Supplier 1: Digi-Key; Mounting Type: SMD; Package: 0603
R80 R89 R94-R97 = RES_51Ω_0603_1%: RES 51 OHM 1% 1/10W 0603; Manufacturer 1: YAGEO; Manufacturer Part Number 1: RC0603FR-0751RL; Supplier 1: Digi-Key; Supplier Part Number 1: 311-51.0HRCT-ND
R99 R100 = RES_100Ω_0603_1%: as R61 on sheet BQ76952_AFE; Supplier Part Number 1: 311-100HRCT-ND; Supplier 1: Digi-Key
TP53-TP55 TP62 = TESTPOINT_1MM_CIRCLE: TESTPOINT 1MM CIRCLE

## Sheet STM32_MCU.SchDoc: LTO 16S BMS
size A4; Engineer: Farris Matar; Organization: TESLA Motors, INC; Address1: 3500 Deer Creek Road; Address2: Palo Alto, CA; Address4: U.S.A.; SheetNumber: 6; SheetTotal: 8
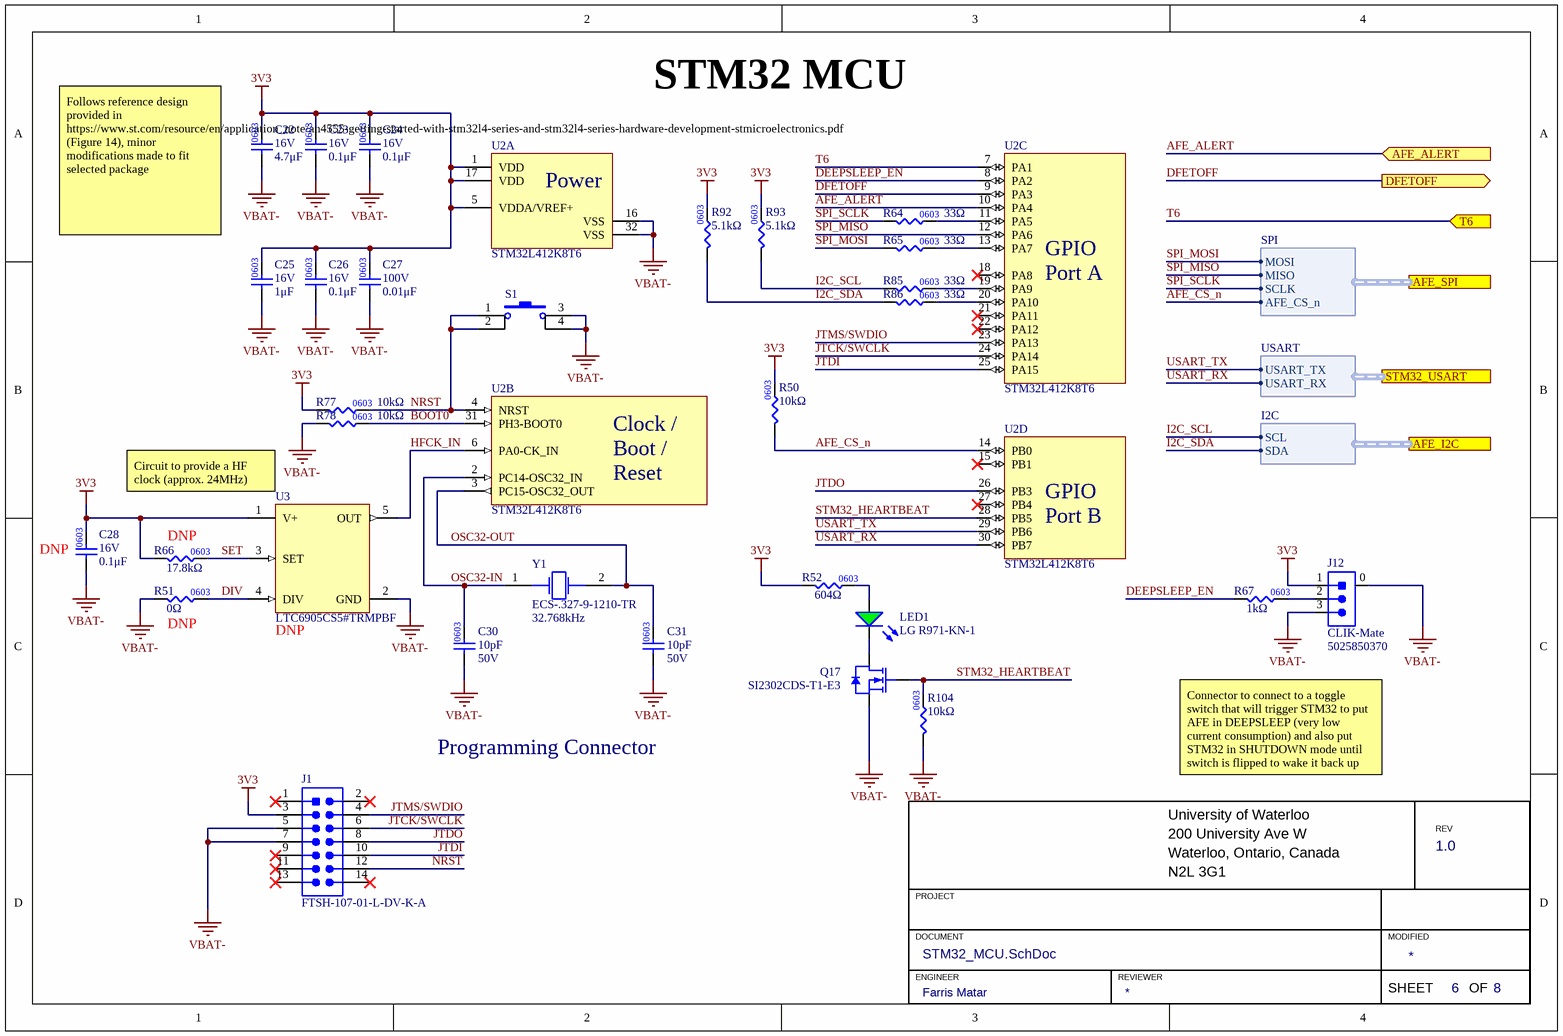
[diagram p4: STM32_MCU.SchDoc]

### Parts
C22  value 4.7μF  Voltage Rating: 16V  [CAP0603]  (hidden comment: CAP_4.7uF_16V_0603)
C23  value 0.1μF  Voltage Rating: 16V  [CAP0603]  (hidden comment: CAP_0.1uF_16V_0603)
C24  value 0.1μF  Voltage Rating: 16V  [CAP0603]  (hidden comment: CAP_0.1uF_16V_0603)
C25  value 1μF  Voltage Rating: 16V  [CAP0603]  (hidden comment: CAP_1uF_16V_0603)
C26  value 0.1μF  Voltage Rating: 16V  [CAP0603]  (hidden comment: CAP_0.1uF_16V_0603)
C27  value 0.01μF  Voltage Rating: 100V  [CAP0603]  (hidden comment: CAP_0.01uF_100V_0603)
C28  value 0.1μF  Voltage Rating: 16V  [CAP0603]  (hidden comment: CAP_0.1uF_16V_0603)
C30  value 10pF  Voltage Rating: 50V  [CAP0603]  (hidden comment: CAP_10pF_50V_0603)
C31  value 10pF  Voltage Rating: 50V  [CAP0603]  (hidden comment: CAP_10pF_50V_0603)
J1  Manufacturer Part Number 1: FTSH-107-01-L-DV-K-A  [SAMTEC-FTSH 7x2 SMD]  (hidden comment: CON_SAMTEC-FTSH_7x2_SMD)
J12  Family: CLIK-Mate  Manufacturer Part Number 1: 5025850370  [MOLEX-5025850370]  (hidden comment: CON_3M_SM_RA)
LED1  Manufacturer Part Number 1: LG R971-KN-1  [LED_0805_GREEN]  (hidden comment: LED_GREEN)
Q17  Manufacturer Part Number 1: SI2302CDS-T1-E3  [SOT23-3]  (hidden comment: NMOS_20V_6A)
R50  value 10kΩ  [RES0603]  (hidden comment: RES_10kΩ_0603_1%)
R51  value 0Ω  [RES0603]  (hidden comment: RES_0Ω_0603)
R52  value 604Ω  [RES0603]  (hidden comment: RES_604Ω_0603_1%)
R64  value 33Ω  [RES0603]  (hidden comment: RES_33Ω_0603_1%)
R65  value 33Ω  [RES0603]  (hidden comment: RES_33Ω_0603_1%)
R66  value 17.8kΩ  [RES0603]  (hidden comment: RES_17.8kΩ_0603_1%)
R67  value 1kΩ  [RES0603]  (hidden comment: RES_1kΩ_0603_1%)
R77  value 10kΩ  [RES0603]  (hidden comment: RES_10kΩ_0603_1%)
R78  value 10kΩ  [RES0603]  (hidden comment: RES_10kΩ_0603_1%)
R85  value 33Ω  [RES0603]  (hidden comment: RES_33Ω_0603_1%)
R86  value 33Ω  [RES0603]  (hidden comment: RES_33Ω_0603_1%)
R92  value 5.1kΩ  [RES0603]  (hidden comment: RES_5.1kΩ_0603_1%)
R93  value 5.1kΩ  [RES0603]  (hidden comment: RES_5.1kΩ_0603_1%)
R104  value 10kΩ  [RES0603]  (hidden comment: RES_10kΩ_0603_1%)
S1  SW_SPST_NO_4.5x4.5  [SPST_PUSHBUTTON_TL3305AF260QG]  (value not drawn)
U2  STM32L412K8T6  [STM-LQFP32]  (parts A,B,C,D of 4)
U3  LTC6905CS5#TRMPBF  [SOT23-5]
Y1  Frequency: 32.768kHz  Manufacturer Part Number 1: ECS-.327-9-1210-TR  [OSC_ECS-327TR-2]  (hidden comment: CRYSTAL_32.768KHZ)

### Ports
AFE_ALERT (in), AFE_I2C (harness I2C), AFE_SPI (harness SPI), DFETOFF (out), STM32_USART (harness USART), T6 (in)

### Harnesses
SPI: MOSI, MISO, SCLK, AFE_CS_n
USART: USART_TX, USART_RX
I2C: SCL, SDA

### Nets
3V3: C22.2 C23.2 C24.2 C25.2 C26.2 C27.2 C28.2 J1.3 J12.1 R50.2 R52.1 R66.1 R77.1 R92.2 R93.2 U2.1(VDD) U2.5(VDDA/VREF+) U2.17(VDD) U3.1(V+)
VBAT-: C22.1 C23.1 C24.1 C25.1 C26.1 C27.1 C28.1 C30.1 C31.1 J1.5 J1.7 J12.0 J12.3 Q17.2(SOURCE) R51.1 R78.1 R104.1 S1.3 S1.4 U2.16(VSS) U2.32(VSS) U3.2(GND)
AFE_ALERT: U2.10(PA4) ; port AFE_ALERT
AFE_CS_n: R50.1 U2.14(PB0) ; port AFE_SPI.AFE_CS_n
BOOT0: R78.2 U2.31(PH3-BOOT0)
DEEPSLEEP_EN: R67.1 U2.8(PA2)
DFETOFF: U2.9(PA3) ; port DFETOFF
DIV: R51.2 U3.4(DIV)
HFCK_IN: U2.6(PA0-CK_IN) U3.5(OUT)
I2C_SCL: R85.1 R93.1 ; port AFE_I2C.SCL
I2C_SDA: R86.1 R92.1 ; port AFE_I2C.SDA
JTCK/SWCLK: J1.6 U2.24(PA14)
JTDI: J1.10 U2.25(PA15)
JTDO: J1.8 U2.26(PB3)
JTMS/SWDIO: J1.4 U2.23(PA13)
NRST: J1.12 R77.2 S1.1 S1.2 U2.4(NRST)
OSC32-IN: C30.2 U2.2(PC14-OSC32_IN) Y1.1
OSC32-OUT: C31.2 U2.3(PC15-OSC32_OUT) Y1.2
SET: R66.2 U3.3(SET)
SPI_MISO: U2.12(PA6) ; port AFE_SPI.MISO
SPI_MOSI: R65.1 ; port AFE_SPI.MOSI
SPI_SCLK: R64.1 ; port AFE_SPI.SCLK
STM32_HEARTBEAT: Q17.1(GATE) R104.2 U2.28(PB5)
T6: U2.7(PA1) ; port T6
USART_RX: U2.30(PB7) ; port STM32_USART.USART_RX
USART_TX: U2.29(PB6) ; port STM32_USART.USART_TX
NetJ12_2: J12.2 R67.2
NetLED1_1: LED1.1(A) R52.2
NetLED1_2: LED1.2(K) Q17.3(DRAIN)
NetR64_2: R64.2 U2.11(PA5)
NetR65_2: R65.2 U2.13(PA7)
NetR85_2: R85.2 U2.19(PA9)
NetR86_2: R86.2 U2.20(PA10)

Not connected (* = marked no-connect by the designer): J1 1* 2* 9* 11* 13* 14*; U2 15(PB1)* 18(PA8)* 21(PA11)* 22(PA12)* 27(PB4)*

### Notes on the sheet
- STM32 MCU
- Follows reference design provided in https://www.st.com/resource/en/application_note/an4555-getting-started-with-stm32l4-series-and-stm32l4-series-hardware-development-stmicroelectronics.pdf (Figure 14), minor modifications made to fit selected package
- (near U3) Circuit to provide a HF clock (approx. 24MHz)
- (near C28) DNP
- (near R66) DNP
- (near R51) DNP
- (near U3) DNP
- (near J1) Programming Connector
- Connector to connect to a toggle switch that will trigger STM32 to put AFE in DEEPSLEEP (very low current consumption) and also put STM32 in SHUTDOWN mode until switch is flipped to wake it back up
- University of Waterloo
- 200 University Ave W
- REV
- PROJECT
- Waterloo, Ontario, Canada
- N2L 3G1
- DOCUMENT
- ENGINEER
- REVIEWER
- MODIFIED
- SHEET
- OF
- (in symbol CAP_0.01uF_100V_0603) 0603
- (in symbol RES_17.8kΩ_0603_1%) 0603
- (in symbol RES_604Ω_0603_1%) 0603
- (in symbol STM32L412K8T6, part A) Power
- (in symbol STM32L412K8T6, part B) Clock / / Boot / / Reset
- (in symbol STM32L412K8T6, part C) GPIO / Port A
- (in symbol STM32L412K8T6, part D) GPIO / Port B

### Library data of the parts
C22 = CAP_4.7uF_16V_0603: CAP CER 4.7UF 16V X6S 0603; Manufacturer Part Number 1: GRM188C81C475KE11D; Manufacturer 1: Murata Electronics; Supplier Part Number 1: 490-13362-1-ND; Supplier 1: Digi-Key; Mounting Type: SMD; Package: 0603; Dielectric: X6S
C23 C24 C26 C28 = CAP_0.1uF_16V_0603: as C1 on sheet Balancing_FETs; Package: 0603; Supplier Part Number 1: 311-1088-1-ND; Supplier 1: Digi-Key; Dielectric: X7R
C25 = CAP_1uF_16V_0603: CAP CER 1UF 16V X7R 0603; Manufacturer 1: Yageo; Manufacturer Part Number 1: CC0603KPX7R7BB105; Supplier Part Number 1: 13-CC0603KPX7R7BB105CT-ND; Supplier 1: Digi-Key; Mounting Type: SMD; Package: 0603; Dielectric: X7R
C27 = CAP_0.01uF_100V_0603: CAP CER 0.01uF 100V X7R 0603; Manufacturer Part Number 1: GCM188R72A103KA37J; Manufacturer 1: Murata Electronics; Supplier Part Number 1: 490-8028-1-ND; Supplier 1: Digi-Key; Dielectric: X7R
C30 C31 = CAP_10pF_50V_0603: CAP CER 10PF 50V X7R 0603; Manufacturer 1: KEMET; Manufacturer Part Number 1: C0603C100J5RAC7867; Package: 0603; Supplier 1: Digi-Key; Supplier Part Number 1: 399-C0603C100J5RAC7867CT-ND
J1 = CON_SAMTEC-FTSH_7x2_SMD: CONN HEADER SMD 14POS 1.27MM; Manufacturer 1: Samtec; Supplier 1: Digi-Key; Mounting Type: SMD; Pitch: 1.27mm; Supplier Part Number 1: FTSH-107-01-L-DV-K-A-ND
J12 = CON_3M_SM_RA: CONN RCPT 3POS 0.059 TIN SMD R/A; Manufacturer 1: Molex; Current Rating: 2A; Voltage Rating: 100V; Pitch: 1.5mm; Supplier 1: Digi-Key; Mounting Type: SMD; Package/Footprint: SMD; Orientation: Right Angle; Supplier Part Number 1: WM12831CT-ND
LED1 = LED_GREEN: LED GREEN DIFFUSED 0805 SMD; Manufacturer 1: OSRAM; Forward Voltage Drop: 2.2V; Package/Footprint: 0805; Supplier Part Number 1: 475-1410-1-ND; Supplier 1: Digi-Key; Mounting Type: SMD
Q17 = NMOS_20V_2.6A: as Q1 on sheet Balancing_FETs; Supplier 1: Digi-Key; Supplier Part Number 1: SI2302CDS-T1-E3CT-ND
R50 R77 R78 R104 = RES_10kΩ_0603_1%: as R59 on sheet BQ76952_AFE; Supplier Part Number 1: RNCP0603FTD10K0CT-ND; Supplier 1: Digi-Key; Mounting Type: SMD; Package: 0603
R51 = RES_0Ω_0603: as R87 on sheet BQ76952_AFE; Supplier Part Number 1: 311-0.0GRCT-ND; Supplier 1: Digi-Key; Mounting Type: SMD; Package: 0603
R52 = RES_604Ω_0603_1%: RES 604 OHM 1% 1/10W 0603; Manufacturer 1: Yageo; Manufacturer Part Number 1: RC0603FR-07604RL; Supplier Part Number 1: 311-604HRCT-ND; Supplier 1: Digi-Key
R64 R65 R85 R86 = RES_33Ω_0603_1%: as R57 on sheet BQ76952_AFE; Supplier 1: Digi-Key; Mounting Type: SMD; Supplier Part Number 1: 541-33.0HCT-ND; Package: 0603
R66 = RES_17.8kΩ_0603_1%: RES 17.8K OHM 1% 1/10W 0603; Manufacturer 1: YAGEO; Manufacturer Part Number 1: RC0603FR-0717K8L; Supplier 1: Digi-Key; Supplier Part Number 1: 311-17.8KHRCT-ND
R67 = RES_1kΩ_0603_1%: as R5 on sheet Balancing_FETs; Supplier Part Number 1: RNCP0603FTD1K00CT-ND; Supplier 1: Digi-Key; Mounting Type: SMD; Package: 0603
R92 R93 = RES_5.1kΩ_0603_1%: as R69 on sheet High_Side_FETs; Mounting Type: SMD; Package: 0603; Supplier 1: Digi-Key; Supplier Part Number 1: 13-RC0603FR-135K1LCT-ND
S1 = SW_SPST_NO_4.5x4.5: SWITCH TACTILE SPST-NO 50MA 12V; Manufacturer Part Number 1: TL3305AF260QG; Manufacturer 1: E-Switch; Mounting Type: SMD; Supplier 1: Digi-Key; Supplier Part Number 1: EG5353CT-ND
U2 = STM32L412K8T6: IC MCU 32BIT 64KB FLASH 32LQFP; Manufacturer 1: STMicroelectronics; Package/Footprint: 32-LQFP; Manufacturer Part Number 1: STM32L412K8T6; Supplier 1: Digi-Key; Supplier Part Number 1: 497-STM32L412K8T6-ND
U3 = IC_OSC_LTC6905: IC OSC SILICON PROG TSOT23-5; Manufacturer 1: Analog Devices Inc.; Package/Footprint: SOT-23-5; Manufacturer Part Number 1: LTC6905CS5#TRMPBF; Supplier 1: Digi-Key; Supplier Part Number 1: 505-LTC6905CS5#TRMPBFCT-ND
Y1 = CRYSTAL_32.768KHZ: CRYSTAL 32.7680KHZ 9PF SMD; Manufacturer 1: ECS Inc.; Supplier 1: Digi-Key; Supplier Part Number 1: XC2283CT-ND

## Sheet Temperature_Sense.SchDoc: LTO 16S BMS
size A4; Engineer: Farris Matar; Organization: TESLA Motors, INC; Address1: 3500 Deer Creek Road; Address2: Palo Alto, CA; Address4: U.S.A.; SheetNumber: 7; SheetTotal: 8
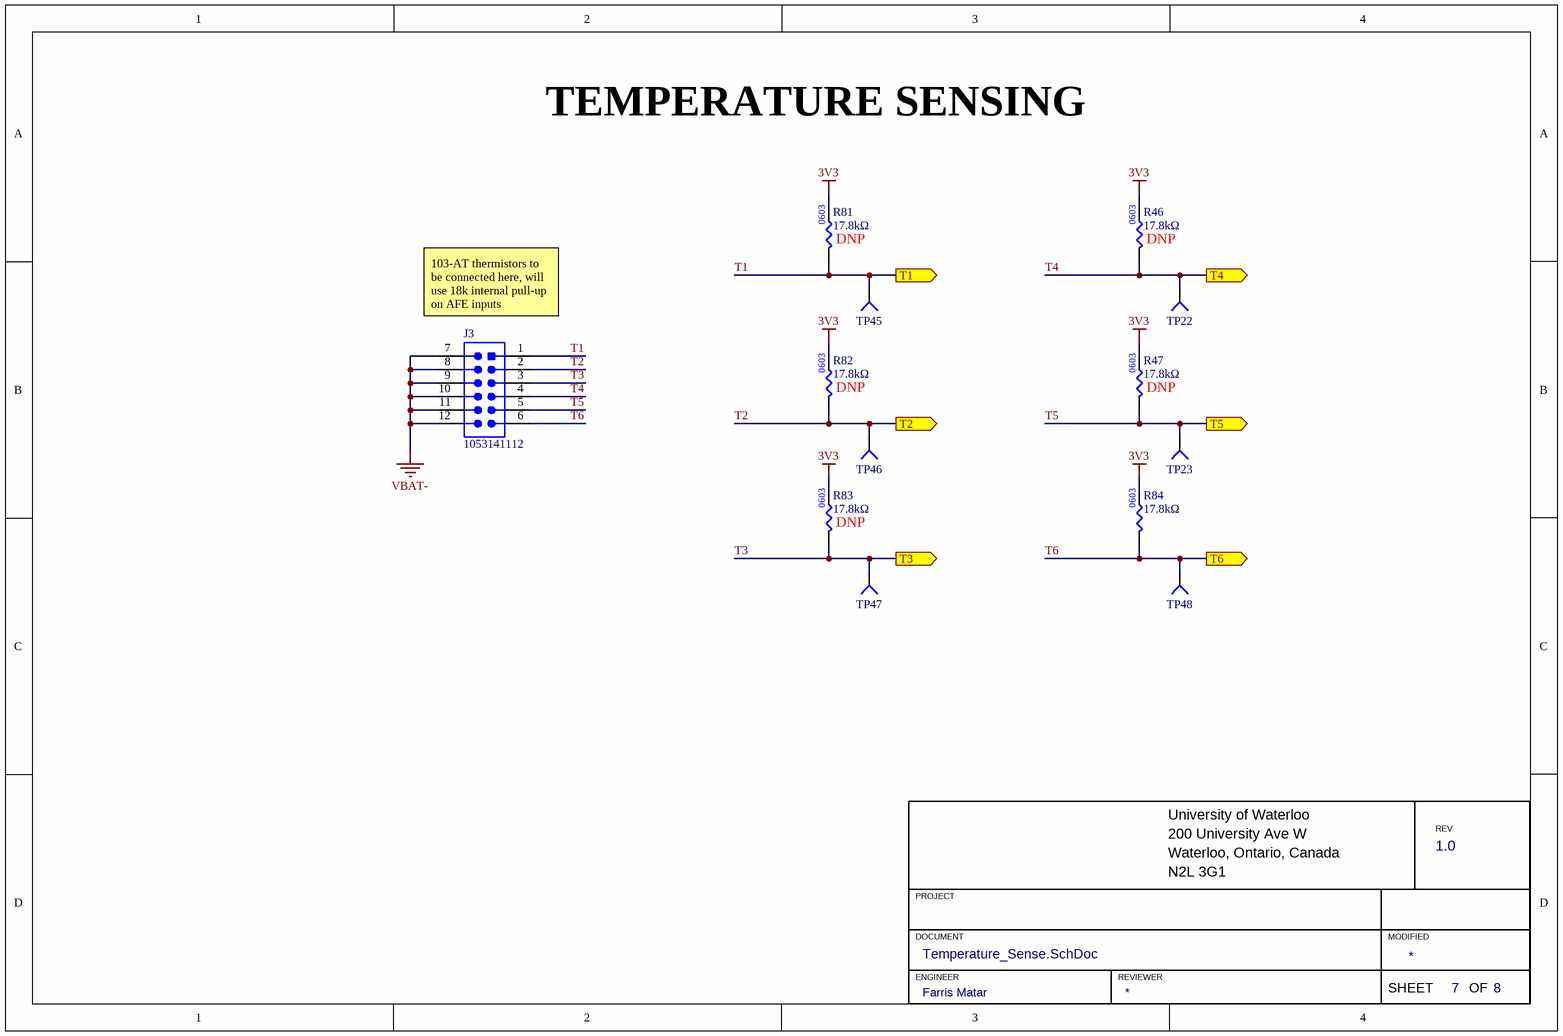
[diagram p5: Temperature_Sense.SchDoc]

### Parts
J3  1053141112  [MOLEX-NANOFIT 6x2 THRA]
R46  value 17.8kΩ  [RES0603]  (hidden comment: RES_17.8kΩ_0603_1%)
R47  value 17.8kΩ  [RES0603]  (hidden comment: RES_17.8kΩ_0603_1%)
R81  value 17.8kΩ  [RES0603]  (hidden comment: RES_17.8kΩ_0603_1%)
R82  value 17.8kΩ  [RES0603]  (hidden comment: RES_17.8kΩ_0603_1%)
R83  value 17.8kΩ  [RES0603]  (hidden comment: RES_17.8kΩ_0603_1%)
R84  value 17.8kΩ  [RES0603]  (hidden comment: RES_17.8kΩ_0603_1%)
TP22  TESTPOINT_1MM_CIRCLE  [TESTPOINT_CIRCLE_1MM]  (value not drawn)  (no BOM)
TP23  TESTPOINT_1MM_CIRCLE  [TESTPOINT_CIRCLE_1MM]  (value not drawn)  (no BOM)
TP45  TESTPOINT_1MM_CIRCLE  [TESTPOINT_CIRCLE_1MM]  (value not drawn)  (no BOM)
TP46  TESTPOINT_1MM_CIRCLE  [TESTPOINT_CIRCLE_1MM]  (value not drawn)  (no BOM)
TP47  TESTPOINT_1MM_CIRCLE  [TESTPOINT_CIRCLE_1MM]  (value not drawn)  (no BOM)
TP48  TESTPOINT_1MM_CIRCLE  [TESTPOINT_CIRCLE_1MM]  (value not drawn)  (no BOM)

### Ports
T1 (out), T2 (out), T3 (out), T4 (out), T5 (out), T6 (out)

### Nets
3V3: R46.2 R47.2 R81.2 R82.2 R83.2 R84.2
VBAT-: J3.7 J3.8 J3.9 J3.10 J3.11 J3.12
T1: J3.1 R81.1 TP45.1(=value) ; port T1
T2: J3.2 R82.1 TP46.1(=value) ; port T2
T3: J3.3 R83.1 TP47.1(=value) ; port T3
T4: J3.4 R46.1 TP22.1(=value) ; port T4
T5: J3.5 R47.1 TP23.1(=value) ; port T5
T6: J3.6 R84.1 TP48.1(=value) ; port T6

### Notes on the sheet
- TEMPERATURE SENSING
- (near R81) DNP
- (near R46) DNP
- (near J3) 103-AT thermistors to be connected here, will use 18k internal pull-up on AFE inputs
- (near R82) DNP
- (near R47) DNP
- (near R83) DNP
- University of Waterloo
- 200 University Ave W
- REV
- PROJECT
- Waterloo, Ontario, Canada
- N2L 3G1
- DOCUMENT
- ENGINEER
- REVIEWER
- MODIFIED
- SHEET
- OF
- (in symbol RES_17.8kΩ_0603_1%) 0603

### Library data of the parts
J3 = CON_MOLEX-NANOFIT_6x2_THRA: CONN HEADER R/A 12POS 2.5MM; Manufacturer 1: Molex; Voltage Rating: 400V; Current Rating: 15A; Pitch: 3.5mm; Supplier 1: Digi-Key; Supplier Part Number 1: WM16911-ND; Manufacturer Part Number 1: 1053141112
R46 R47 R81-R84 = RES_17.8kΩ_0603_1%: as R66 on sheet STM32_MCU; Supplier Part Number 1: 311-17.8KHRCT-ND; Supplier 1: Digi-Key
TP22 TP23 TP45-TP48 = TESTPOINT_1MM_CIRCLE: TESTPOINT 1MM CIRCLE

## Sheet Pack_Interface.SchDoc: LTO 16S BMS
size A4; Engineer: Farris Matar; Organization: TESLA Motors, INC; Address1: 3500 Deer Creek Road; Address2: Palo Alto, CA; Address4: U.S.A.; SheetNumber: 8; SheetTotal: 8
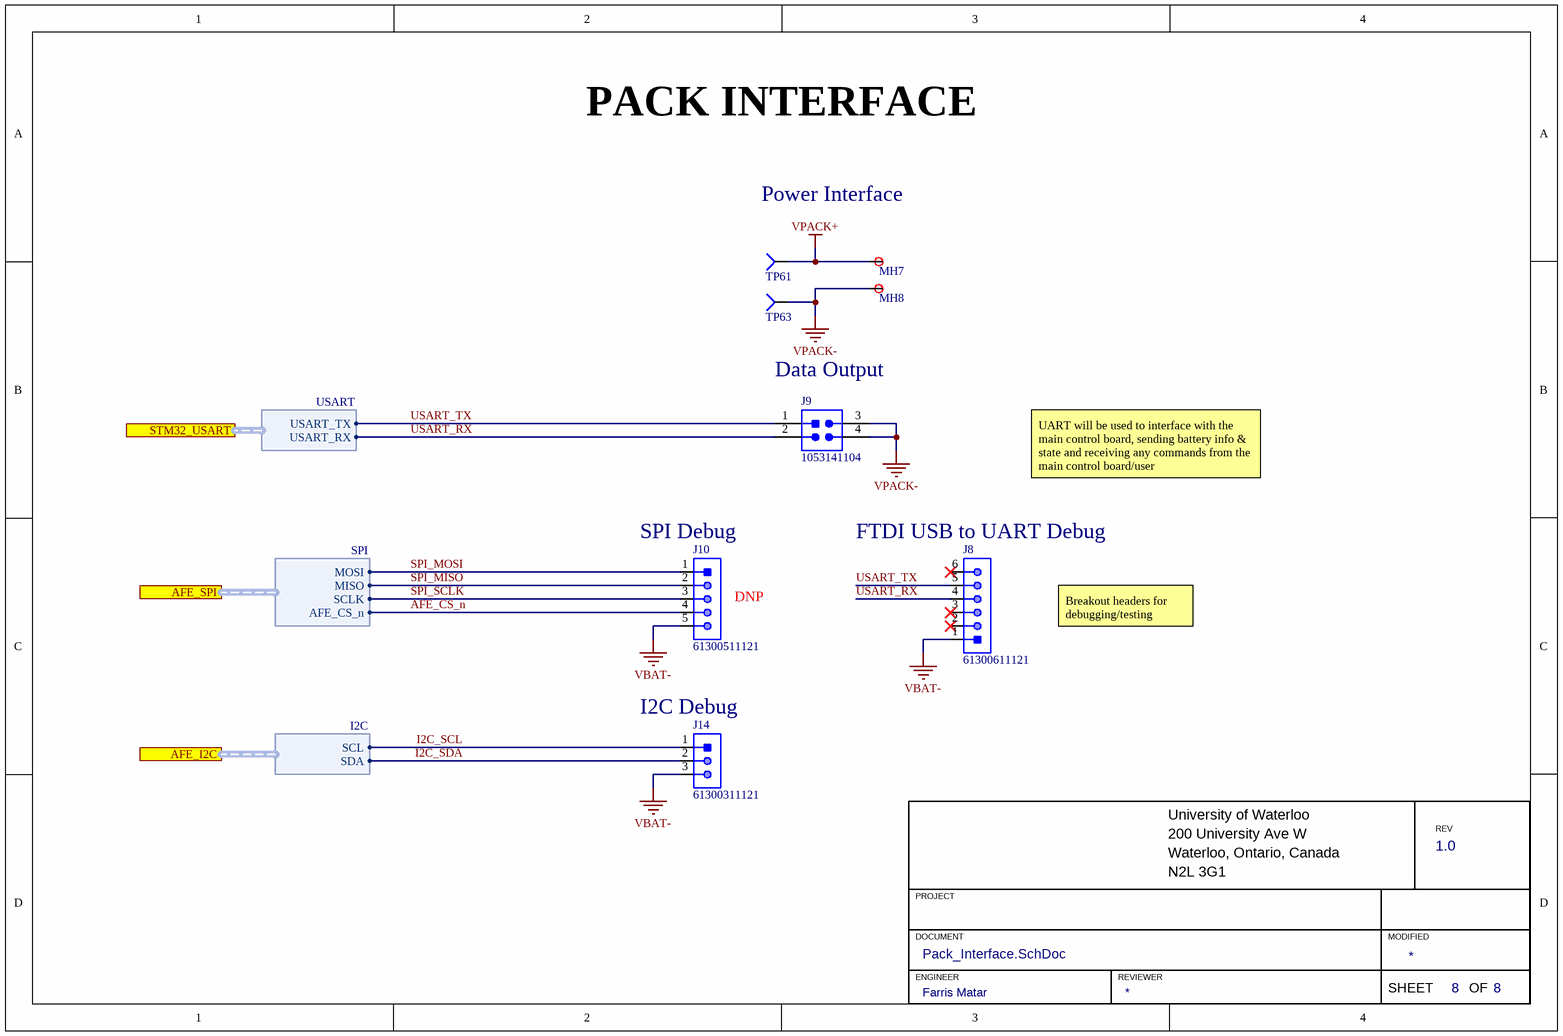
[diagram p6: Pack_Interface.SchDoc]

### Parts
J8  Manufacturer Part Number 1: 61300611121  [HDR1X6]  (hidden comment: HEADER 6x1)
J9  Manufacturer Part Number 1: 1053141104  [MOLEX-NANOFIT 2x2 THRA]  (hidden comment: 0430450412)
J10  Manufacturer Part Number 1: 61300511121  [HDR1X5]  (hidden comment: HEADER 5x1)
J14  Manufacturer Part Number 1: 61300311121  [HDR1X3]  (hidden comment: HEADER 3x1)
MH7  MOUNTING_HOLE_M5  [MOUNTING_HOLE_5mm]  (value not drawn)  (no BOM)
MH8  MOUNTING_HOLE_M5  [MOUNTING_HOLE_5mm]  (value not drawn)  (no BOM)
TP61  TESTPOINT_SMD_LOOP  [S1751-46R]  (value not drawn)
TP63  TESTPOINT_SMD_LOOP  [S1751-46R]  (value not drawn)

### Ports
AFE_I2C (harness I2C), AFE_SPI (harness SPI), STM32_USART (harness USART)

### Harnesses
USART: USART_TX, USART_RX
SPI: MOSI, MISO, SCLK, AFE_CS_n
I2C: SCL, SDA

### Nets
VBAT-: J8.1 J10.5 J14.3
VPACK+: MH7.0 TP61.1(=value)
VPACK-: J9.3 J9.4 MH8.0 TP63.1(=value)
AFE_CS_n: J10.4 ; port AFE_SPI.AFE_CS_n
I2C_SCL: J14.1 ; port AFE_I2C.SCL
I2C_SDA: J14.2 ; port AFE_I2C.SDA
SPI_MISO: J10.2 ; port AFE_SPI.MISO
SPI_MOSI: J10.1 ; port AFE_SPI.MOSI
SPI_SCLK: J10.3 ; port AFE_SPI.SCLK
USART_RX: J8.4 J9.2 ; port STM32_USART.USART_RX
USART_TX: J8.5 J9.1 ; port STM32_USART.USART_TX

Not connected (* = marked no-connect by the designer): J8 2* 3* 6*

### Notes on the sheet
- PACK INTERFACE
- Power Interface
- Data Output
- UART will be used to interface with the main control board, sending battery info & state and receiving any commands from the main control board/user
- (near J10) SPI Debug
- (near J8) FTDI USB to UART Debug
- (near J10) DNP
- Breakout headers for debugging/testing
- (near J14) I2C Debug
- University of Waterloo
- 200 University Ave W
- REV
- PROJECT
- Waterloo, Ontario, Canada
- N2L 3G1
- DOCUMENT
- ENGINEER
- REVIEWER
- MODIFIED
- SHEET
- OF

### Library data of the parts
J8 = HEADER 6x1: CONN HEADER VERT 6POS 2.54MM; Manufacturer 1: Würth Elektronik; Supplier 1: Digi-Key; Mounting Type: TH; Pitch: 2.54mm; Supplier Part Number 1: 732-5319-ND
J9 = CON_MOLEX-NANOFIT_2x2_THRA: CONN HEADER R/A 4POS 2.5MM; Manufacturer 1: Molex; Voltage Rating: 250V; Current Rating: 7.5A; Pitch: 2.5mm; Supplier 1: Digi-Key; Supplier Part Number 1: WM16907-ND
J10 = HEADER 5x1: CONN HEADER VERT 5POS 2.54MM; Manufacturer 1: Würth Elektronik; Supplier 1: Digi-Key; Mounting Type: TH; Pitch: 2.54mm; Supplier Part Number 1: 732-5318-ND
J14 = HEADER 3x1: CONN HEADER VERT 3POS 2.54MM; Manufacturer 1: Würth Elektronik; Supplier 1: Digi-Key; Mounting Type: TH; Pitch: 2.54mm; Supplier Part Number 1: 732-5316-ND
TP61 TP63 = TESTPOINT_SMD_LOOP: as TP1 on sheet Battery_Interface; Supplier 1: Digi-Key; Manufacturer Part Number 1: S1751-46R; Mounting Type: SMD; Package/Footprint: SMD; Supplier Part Number 1: 952-1478-1-ND

## Nets that join several sheets
3V3: BQ76952_AFE (C19.2 TP3.1 U1.35), STM32_MCU (19 pins), Temperature_Sense (6 pins)
VBAT+: Battery_Interface (F1.2 TP2.1), BQ76952_AFE (D17.1 D18.1)
VBAT-: Battery_Interface (6 pins), BQ76952_AFE (10 pins), Balancing_FETs (C13.1 C16.1), High_Side_FETs (D22.1 D23.1), STM32_MCU (22 pins), Temperature_Sense (6 pins), Pack_Interface (J8.1 J10.5 J14.3)
VPACK-: BQ76952_AFE (C32.2 R62.1 R63.2), Pack_Interface (J9.3 J9.4 MH8.0 TP63.1)

## Assembly variants
BUILD: not fitted C28 J10 R46 R47 R51 R57 R66 R81 R82 R83 R87 R88 U3